# EAGLE design Solarregler (EAGLE 7.7.0)
TITLE: Hutschienen-Modul mit CAN-Bus und zwei ansteuerbaren Relais

## Sheet 1 of 6
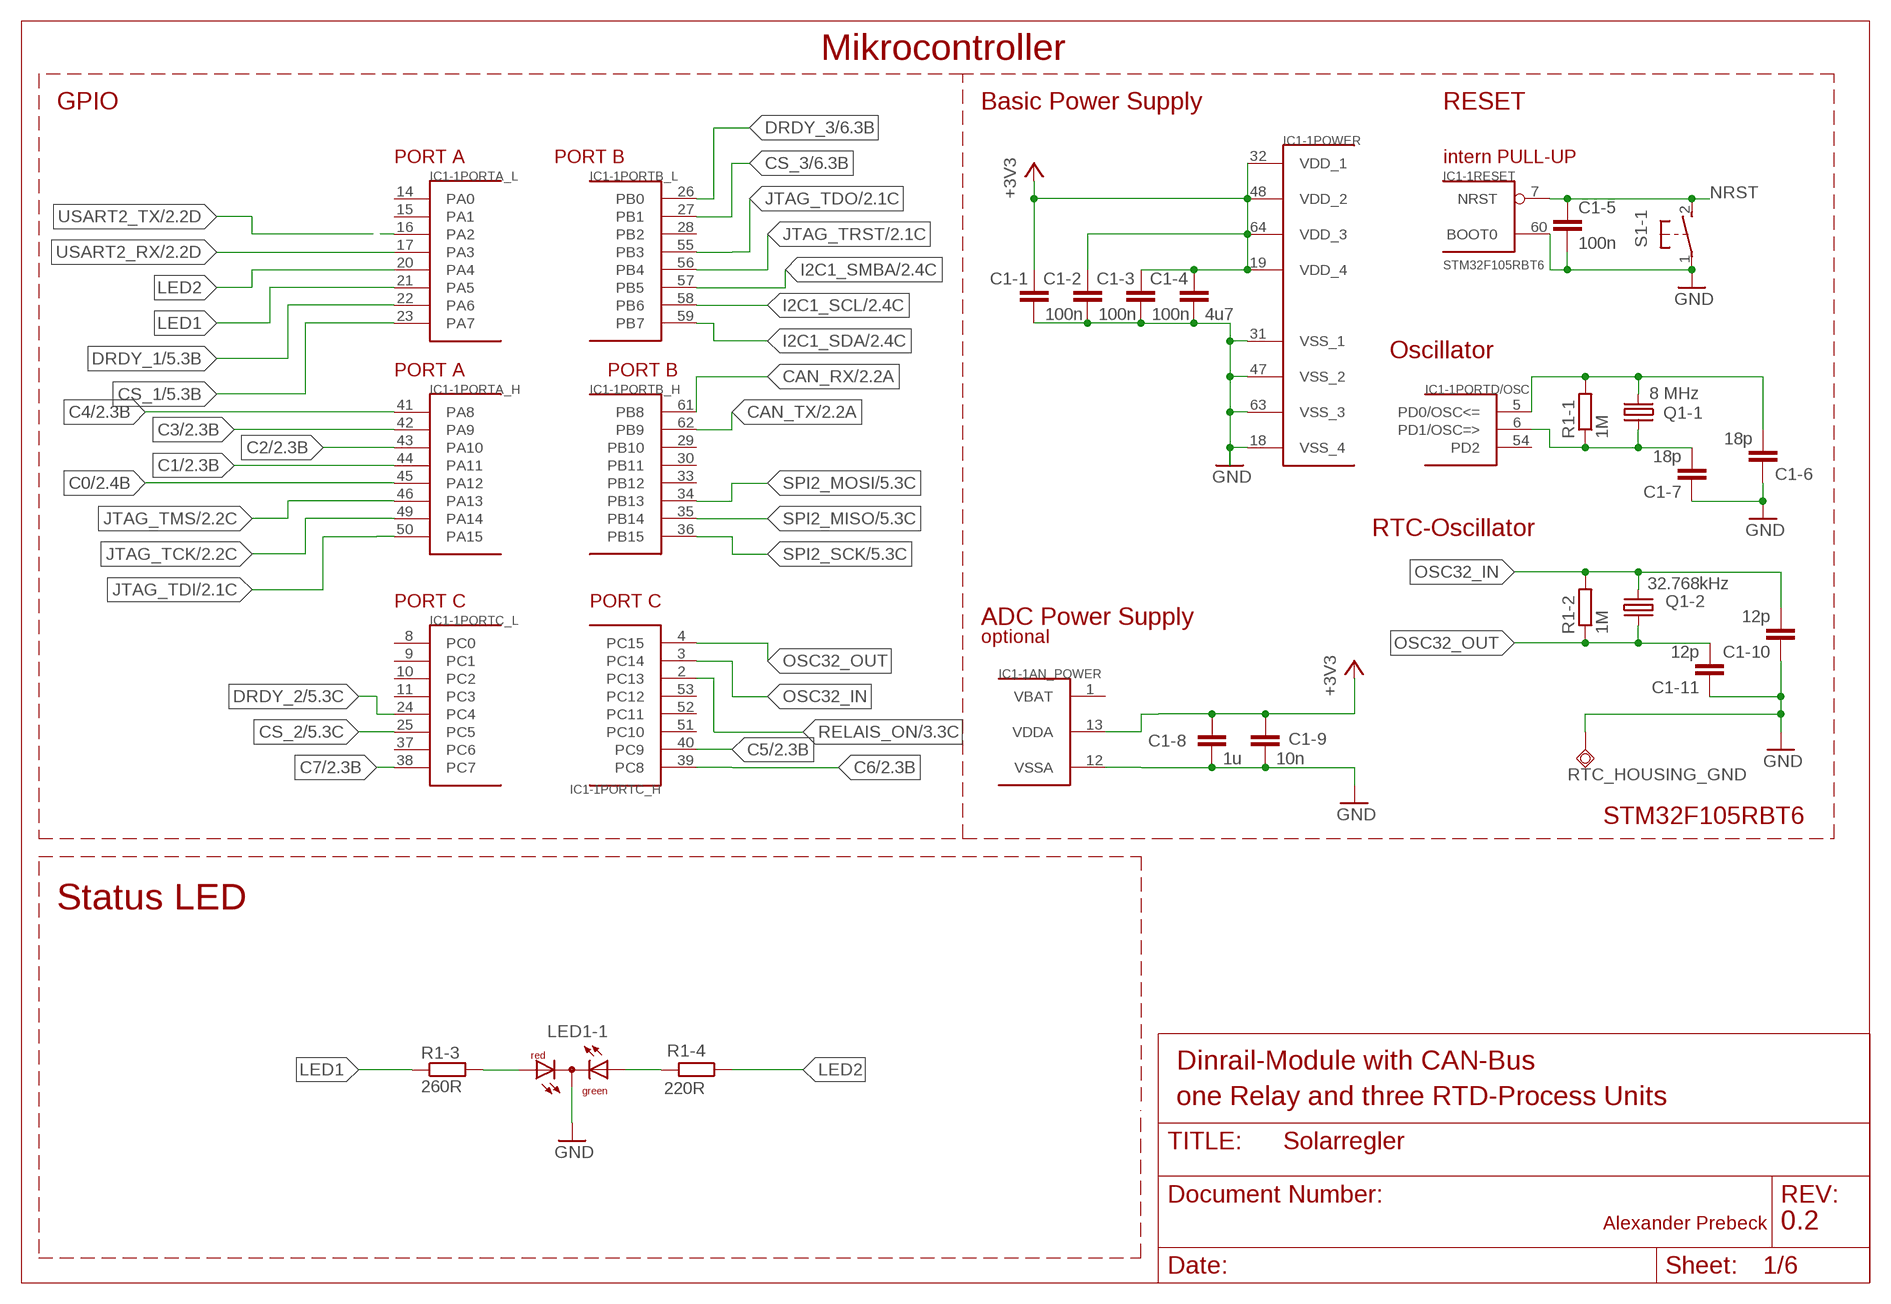
[diagram p0: schematic, sheet 1]

### Parts
C1-1  100n  C-EUC0603  [C0603]
C1-2  100n  C-EUC0603  [C0603]
C1-3  100n  C-EUC0603  [C0603]
C1-4  4u7  C-EUC1206  [C1206]
C1-5  100n  C-EUC0603  [C0603]
C1-6  18p  C-EUC0603  [C0603]
C1-7  18p  C-EUC0603  [C0603]
C1-8  1u  C-EUC0805  [C0805]
C1-9  10n  C-EUC0603  [C0603]
C1-10  12p  C-EUC0603  [C0603]
C1-11  12p  C-EUC0603  [C0603]
IC1-1  STM32F105RBT6  STM32F10XRXT6  [TQFP64]
LED1-1  DUOLED-RG-C  [DUOLED-C-5MM]
Q1-1  8 MHz  SMD_QUARZ_6X3.5MM  [SMD_QUARZ_6X3.5MM]
Q1-2  32.768kHz  QUARZ_RTC_TH  [THROUGH_HOLE_QUARZ_RTC]
R1-1  1M  R-EU_R0603  [R0603]
R1-2  1M  R-EU_R0603  [R0603]
R1-3  260R  R-EU_R0603  [R0603]
R1-4  220R  R-EU_R0603  [R0603]
RTC_HOUSING_GND  TPSQTP20SQ  [TP20SQ]
S1-1  31-XX  [B3F-31XX]

### Nets
+3V3: C1-1.1 C1-2.1 C1-3.1 C1-4.1 C1-8.1 C1-9.1 IC1-1.13(AN_POWER:VDDA) IC1-1.19(POWER:VDD_4) IC1-1.32(POWER:VDD_1) IC1-1.48(POWER:VDD_2) IC1-1.64(POWER:VDD_3) ; also sheet 2,3,5,6
C0: IC1-1.45(PORTA_H:PA12) ; also sheet 2
C1: IC1-1.44(PORTA_H:PA11) ; also sheet 2
C2: IC1-1.43(PORTA_H:PA10) ; also sheet 2
C3: IC1-1.42(PORTA_H:PA9) ; also sheet 2
C4: IC1-1.41(PORTA_H:PA8) ; also sheet 2
C5: IC1-1.40(PORTC_H:PC9) ; also sheet 2
C6: IC1-1.39(PORTC_H:PC8) ; also sheet 2
C7: IC1-1.38(PORTC_L:PC7) ; also sheet 2
CAN_RX: IC1-1.61(PORTB_H:PB8) ; also sheet 2
CAN_TX: IC1-1.62(PORTB_H:PB9) ; also sheet 2
CS_1: IC1-1.23(PORTA_L:PA7) ; also sheet 5
CS_2: IC1-1.25(PORTC_L:PC5) ; also sheet 5
CS_3: IC1-1.27(PORTB_L:PB1) ; also sheet 6
DRDY_1: IC1-1.22(PORTA_L:PA6) ; also sheet 5
DRDY_2: IC1-1.24(PORTC_L:PC4) ; also sheet 5
DRDY_3: IC1-1.26(PORTB_L:PB0) ; also sheet 6
GND: C1-1.2 C1-2.2 C1-3.2 C1-4.2 C1-5.2 C1-6.1 C1-7.1 C1-8.2 C1-9.2 C1-10.1 C1-11.1 IC1-1.12(AN_POWER:VSSA) IC1-1.18(POWER:VSS_4) IC1-1.31(POWER:VSS_1) IC1-1.47(POWER:VSS_2) IC1-1.60(RESET:BOOT0) IC1-1.63(POWER:VSS_3) LED1-1.C RTC_HOUSING_GND.TP S1-1.1(P) ; also sheet 2,3,4,5,6
I2C1_SCL: IC1-1.58(PORTB_L:PB6) ; also sheet 2,4
I2C1_SDA: IC1-1.59(PORTB_L:PB7) ; also sheet 2,4
I2C1_SMBA: IC1-1.57(PORTB_L:PB5) ; also sheet 2
JTAG_TCK: IC1-1.49(PORTA_H:PA14) ; also sheet 2
JTAG_TDI: IC1-1.50(PORTA_H:PA15) ; also sheet 2
JTAG_TDO: IC1-1.55(PORTB_L:PB3) ; also sheet 2
JTAG_TMS: IC1-1.46(PORTA_H:PA13) ; also sheet 2
JTAG_TRST: IC1-1.56(PORTB_L:PB4) ; also sheet 2
LED1: IC1-1.21(PORTA_L:PA5) R1-3.1
LED2: IC1-1.20(PORTA_L:PA4) R1-4.1
N$4: LED1-1.AX(AG) R1-4.2
N$13: LED1-1.AR R1-3.2
N$24: C1-7.2 IC1-1.6(PORTD/OSC:PD1/OSC=>) Q1-1.1 R1-1.1
N$29: C1-6.2 IC1-1.5(PORTD/OSC:PD0/OSC<=) Q1-1.2 R1-1.2
NRST: C1-5.1 IC1-1.7(RESET:NRST) S1-1.2(S) ; also sheet 2
OSC32_IN: C1-10.2 IC1-1.3(PORTC_H:PC14) Q1-2.P$1 R1-2.2
OSC32_OUT: C1-11.2 IC1-1.4(PORTC_H:PC15) Q1-2.P$2 R1-2.1
RELAIS_ON: IC1-1.2(PORTC_H:PC13) ; also sheet 3
SPI2_MISO: IC1-1.35(PORTB_H:PB14) ; also sheet 5,6
SPI2_MOSI: IC1-1.34(PORTB_H:PB13) ; also sheet 5,6
SPI2_SCK: IC1-1.36(PORTB_H:PB15) ; also sheet 5,6
USART2_RX: IC1-1.17(PORTA_L:PA3) ; also sheet 2
USART2_TX: IC1-1.16(PORTA_L:PA2) ; also sheet 2
Unconnected: IC1-1.8(PORTC_L:PC0) IC1-1.9(PORTC_L:PC1) IC1-1.10(PORTC_L:PC2) IC1-1.11(PORTC_L:PC3) IC1-1.14(PORTA_L:PA0) IC1-1.15(PORTA_L:PA1) IC1-1.28(PORTB_L:PB2) IC1-1.29(PORTB_H:PB10) IC1-1.30(PORTB_H:PB11) IC1-1.33(PORTB_H:PB12) IC1-1.37(PORTC_L:PC6) IC1-1.51(PORTC_H:PC10) IC1-1.52(PORTC_H:PC11) IC1-1.53(PORTC_H:PC12) IC1-1.54(PORTD/OSC:PD2)

### Notes on the sheet
- Mikrocontroller
- GPIO | Basic Power Supply | RESET
- PORT A | PORT B | intern PULL-UP
- Oscillator
- PORT A | PORT B
- RTC-Oscillator
- PORT C | PORT C
- ADC Power Supply
- optional
- STM32F105RBT6
- Status LED
- Dinrail-Module with CAN-Bus
- one Relay and three RTD-Process Units
- Alexander Prebeck | 0.2

## Sheet 2 of 6
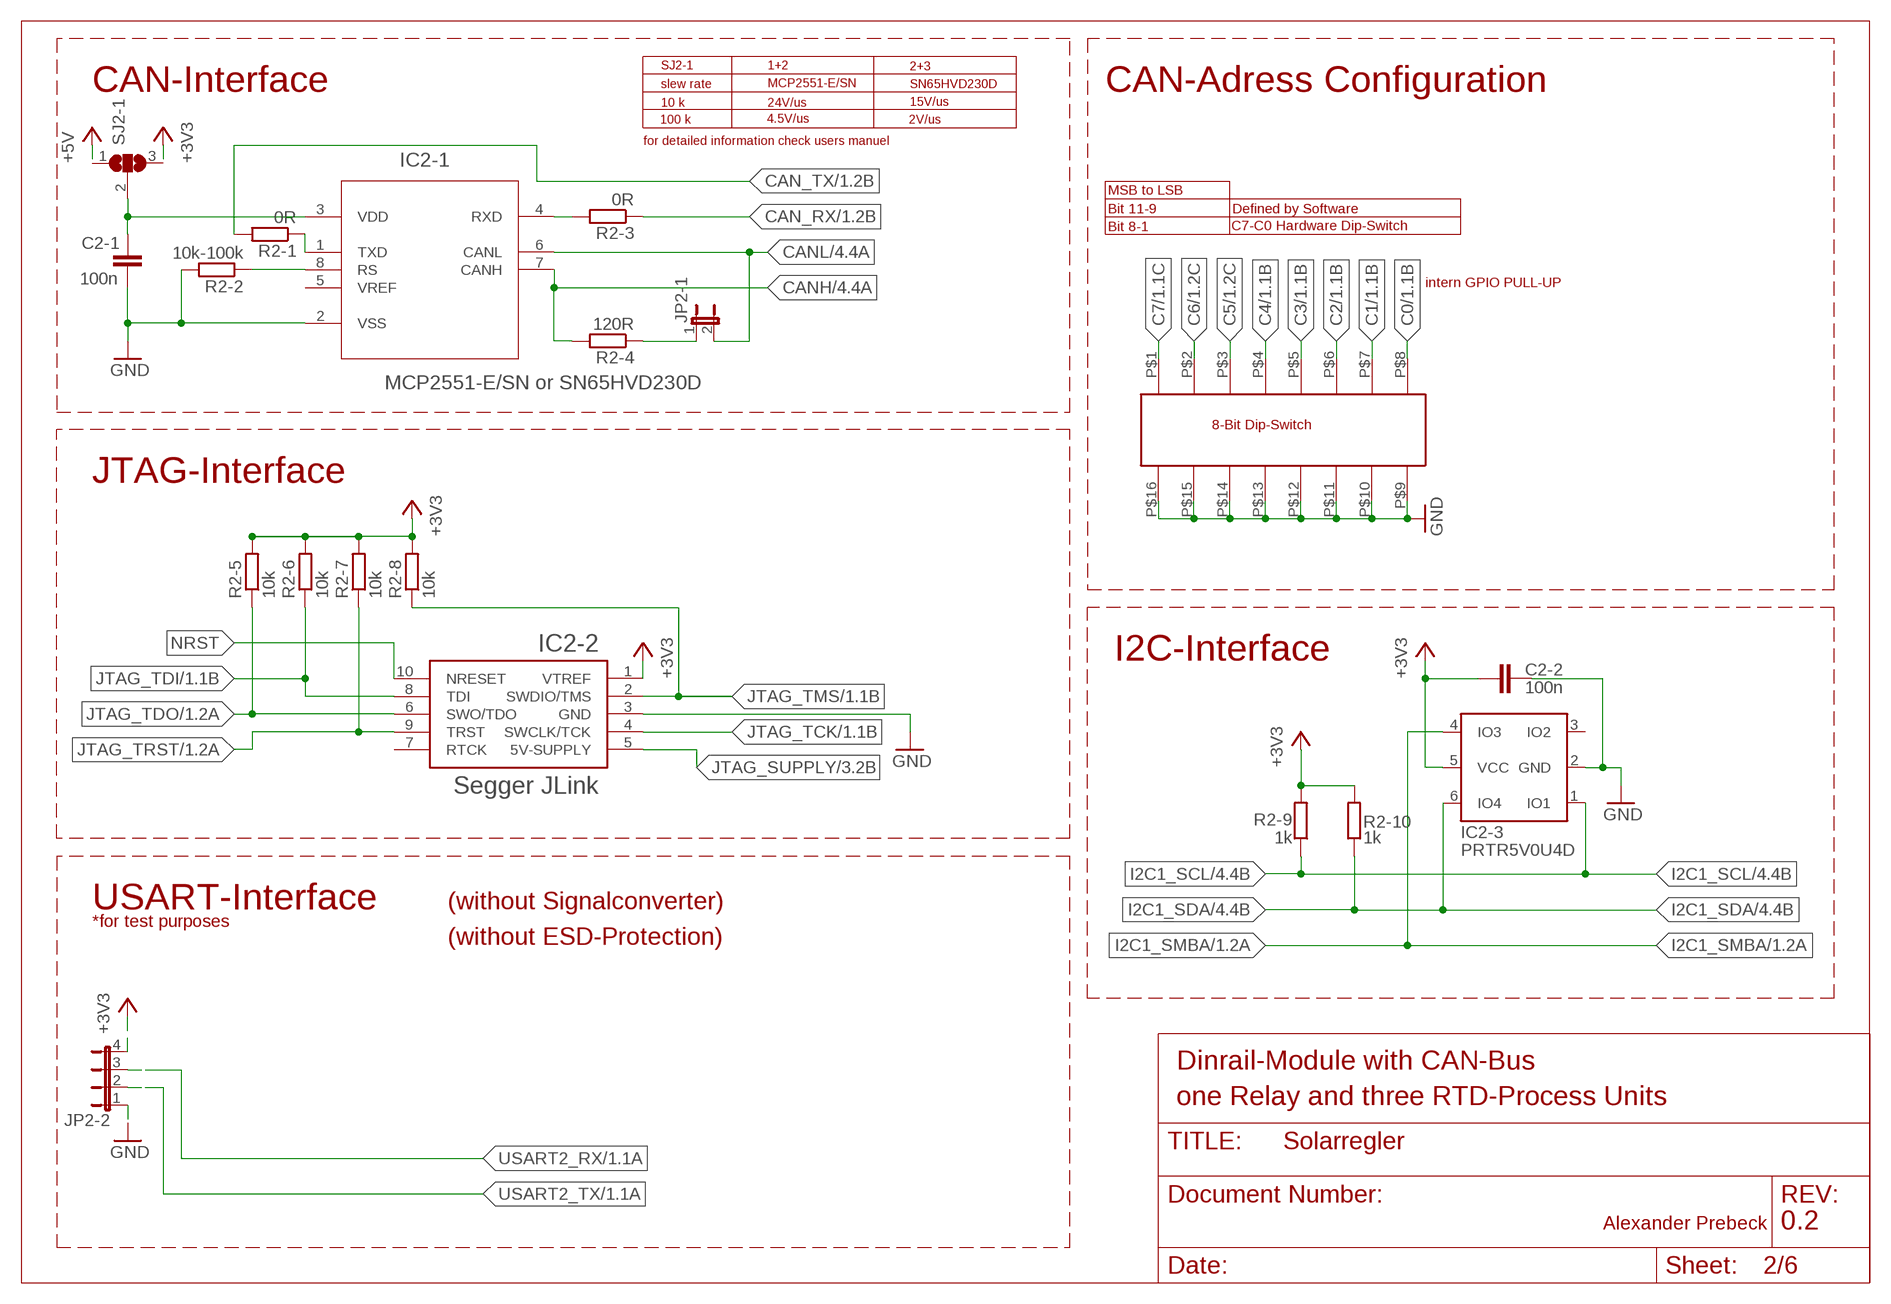
[diagram p1: schematic, sheet 2]

### Parts
C2-1  100n  C-EUC0603  [C0603]
C2-2  100n  C-EUC0603  [C0603]
DIP21  MULTICOMP  [MULTICOMP]
IC2-1  MCP2551-E/SN or SN65HVD230D  MCP2551-E/SN  [SOIC127P600X175-8N]
IC2-2  J-LINK-10PIN-HOLES  [J-LINK-10PIN-HOLES]
IC2-3  PRTR5V0U4D  [SC74]
JP2-1  JP1E  [JP1]
JP2-2  JP4E  [JP4]
R2-1  0R  R-EU_R0603  [R0603]
R2-2  10k-100k  R-EU_R0603  [R0603]
R2-3  0R  R-EU_R0603  [R0603]
R2-4  120R  R-EU_R0603  [R0603]
R2-5  10k  R-EU_R0603  [R0603]
R2-6  10k  R-EU_R0603  [R0603]
R2-7  10k  R-EU_R0603  [R0603]
R2-8  10k  R-EU_R0603  [R0603]
R2-9  1k  R-EU_R0603  [R0603]
R2-10  1k  R-EU_R0603  [R0603]
SJ2-1  SJ2W  [SJ_2]

### Nets
+3V3: C2-2.1 IC2-2.1(VTREF) IC2-3.5(VCC) JP2-2.4 R2-5.2 R2-6.2 R2-7.2 R2-8.2 R2-9.2 R2-10.2 SJ2-1.3 ; also sheet 1,3,5,6
+5V: SJ2-1.1 ; also sheet 3
C0: DIP21.P$8 ; also sheet 1
C1: DIP21.P$7 ; also sheet 1
C2: DIP21.P$6 ; also sheet 1
C3: DIP21.P$5 ; also sheet 1
C4: DIP21.P$4 ; also sheet 1
C5: DIP21.P$3 ; also sheet 1
C6: DIP21.P$2 ; also sheet 1
C7: DIP21.P$1 ; also sheet 1
CAN_RX: R2-3.1 ; also sheet 1
CAN_TERM2: JP2-1.1 R2-4.1
CAN_TX: R2-1.2 ; also sheet 1
CANH: IC2-1.7(CANH) R2-4.2 ; also sheet 4
CANL: IC2-1.6(CANL) JP2-1.2 ; also sheet 4
GND: C2-1.2 C2-2.2 DIP21.P$9 DIP21.P$10 DIP21.P$11 DIP21.P$12 DIP21.P$13 DIP21.P$14 DIP21.P$15 DIP21.P$16 IC2-1.2(VSS) IC2-2.3(GND) IC2-3.2(GND) JP2-2.1 R2-2.2 ; also sheet 1,3,4,5,6
I2C1_SCL: IC2-3.1(IO1) R2-9.1 ; also sheet 1,4
I2C1_SDA: IC2-3.6(IO4) R2-10.1 ; also sheet 1,4
I2C1_SMBA: IC2-3.4(IO3) ; also sheet 1
JTAG_SUPPLY: IC2-2.5(5V-SUPPLY) ; also sheet 3
JTAG_TCK: IC2-2.4(SWCLK/TCK) ; also sheet 1
JTAG_TDI: IC2-2.8(TDI) R2-6.1 ; also sheet 1
JTAG_TDO: IC2-2.6(SWO/TDO) R2-5.1 ; also sheet 1
JTAG_TMS: IC2-2.2(SWDIO/TMS) R2-8.1 ; also sheet 1
JTAG_TRST: IC2-2.9(TRST) R2-7.1 ; also sheet 1
N$5: IC2-1.4(RXD) R2-3.2
N$8: IC2-1.1(TXD) R2-1.1
N$9: IC2-1.8(RS) R2-2.1
N$21: C2-1.1 IC2-1.3(VDD) SJ2-1.2
NRST: IC2-2.10(NRESET) ; also sheet 1
USART2_RX: JP2-2.3 ; also sheet 1
USART2_TX: JP2-2.2 ; also sheet 1
Unconnected: IC2-1.5(VREF) IC2-2.7(RTCK) IC2-3.3(IO2)

### Notes on the sheet
- SJ2-1 | 1+2 | 2+3
- slew rate | MCP2551-E/SN | SN65HVD230D
- CAN-Interface | CAN-Adress Configuration
- 10 k | 24V/us | 15V/us
- 100 k | 4.5V/us | 2V/us
- for detailed information check users manuel
- MSB to LSB
- Bit 11-9 | Defined by Software
- Bit 8-1 | C7-C0 Hardware Dip-Switch
- intern GPIO PULL-UP
- 8-Bit Dip-Switch
- JTAG-Interface
- I2C-Interface
- USART-Interface | (without Signalconverter)
- *for test purposes
- (without ESD-Protection)
- Dinrail-Module with CAN-Bus
- one Relay and three RTD-Process Units
- Alexander Prebeck | 0.2

## Sheet 3 of 6
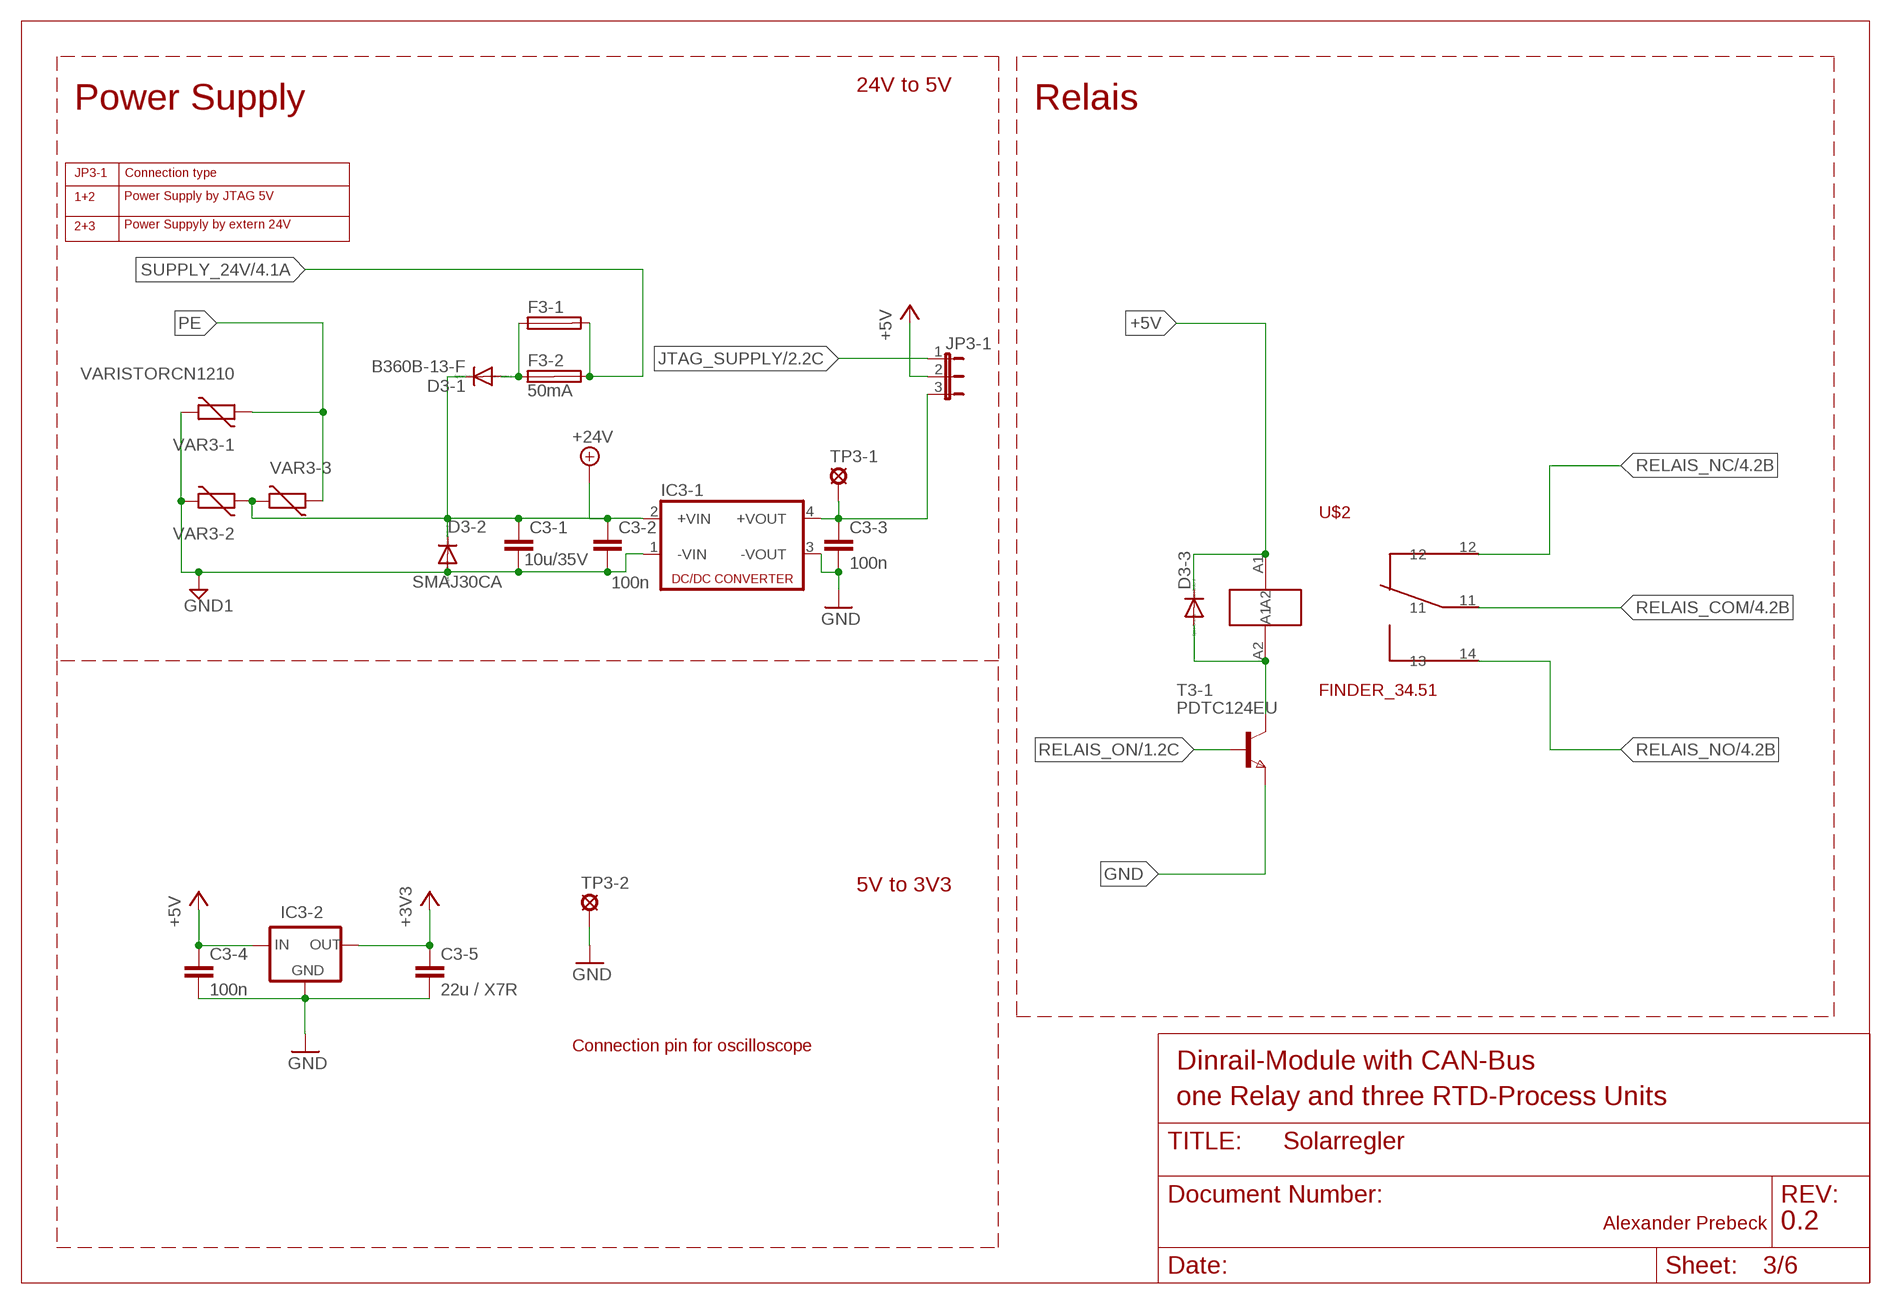
[diagram p2: schematic, sheet 3]

### Parts
C3-1  10u/35V  C-EUC0805  [C0805]
C3-2  100n  C-EUC0603  [C0603]
C3-3  100n  C-EUC0603  [C0603]
C3-4  100n  C-EUC0603  [C0603]
C3-5  22u / X7R  C-EUC0805  [C0805]
D3-1  B360B-13-F  DIODE-SMB  [SMB]
D3-2  SMAJ30CA  DIODE-DO214AA  [DO214AA]
D3-3  DIODE-SMB  [SMB]
F3-1  FUSE_1210  [1210]
F3-2  50mA  SHK20Q  [SHK20Q]
IC3-1  SIM1  [4SIL]
IC3-2  MIC5209  [SOT223]
JP3-1  JP2E  [JP2]
T3-1  PDTC124EU  NPNSOT323  [SOT323]
TP3-1  LSP10  [LSP10]
TP3-2  LSP10  [LSP10]
U$2  FINDER_34.51  [SERIES_34]
VAR3-1  VARISTORCN1210  [CT/CN1210]
VAR3-2  VARISTORCN1210  [CT/CN1210]
VAR3-3  VARISTORCN1210  [CT/CN1210]

### Nets
+3V3: C3-5.1 IC3-2.3(OUT) ; also sheet 1,2,5,6
+5V: C3-4.1 D3-3.C IC3-2.1(IN) JP3-1.2 U$2.A1 ; also sheet 2
+24V [24V]: C3-1.1 C3-2.1 D3-1.C D3-2.C IC3-1.2(+VIN) VAR3-2.2 VAR3-3.2
GND: C3-3.2 C3-4.2 C3-5.2 IC3-1.3(-VOUT) IC3-2.2(GND) IC3-2.4(GND) T3-1.3(E) TP3-2.MP ; also sheet 1,2,4,5,6
GND1 [24V]: C3-1.2 C3-2.2 D3-2.A IC3-1.1(-VIN) VAR3-1.1 VAR3-2.1 ; also sheet 4
JTAG_SUPPLY: JP3-1.1 ; also sheet 2
N$10: D3-3.A T3-1.1(C) U$2.A2
N$17: C3-3.1 IC3-1.4(+VOUT) JP3-1.3 TP3-1.MP
N$19 [24V]: D3-1.A F3-1.1 F3-2.1A
PE [24V]: VAR3-1.2 VAR3-3.1 ; also sheet 4
RELAIS_COM [230V]: U$2.11 ; also sheet 4
RELAIS_NC [230V]: U$2.12 ; also sheet 4
RELAIS_NO [230V]: U$2.14 ; also sheet 4
RELAIS_ON: T3-1.2(B) ; also sheet 1
SUPPLY_24V [24V]: F3-1.2 F3-2.2A ; also sheet 4
Unconnected: F3-2.1B F3-2.2B

### Notes on the sheet
- 24V to 5V
- Power Supply | Relais
- JP3-1 | Connection type
- 1+2 | Power Supply by JTAG 5V
- 2+3 | Power Suppyly by extern 24V
- 5V to 3V3
- Connection pin for oscilloscope
- Dinrail-Module with CAN-Bus
- one Relay and three RTD-Process Units
- Alexander Prebeck | 0.2

## Sheet 4 of 6
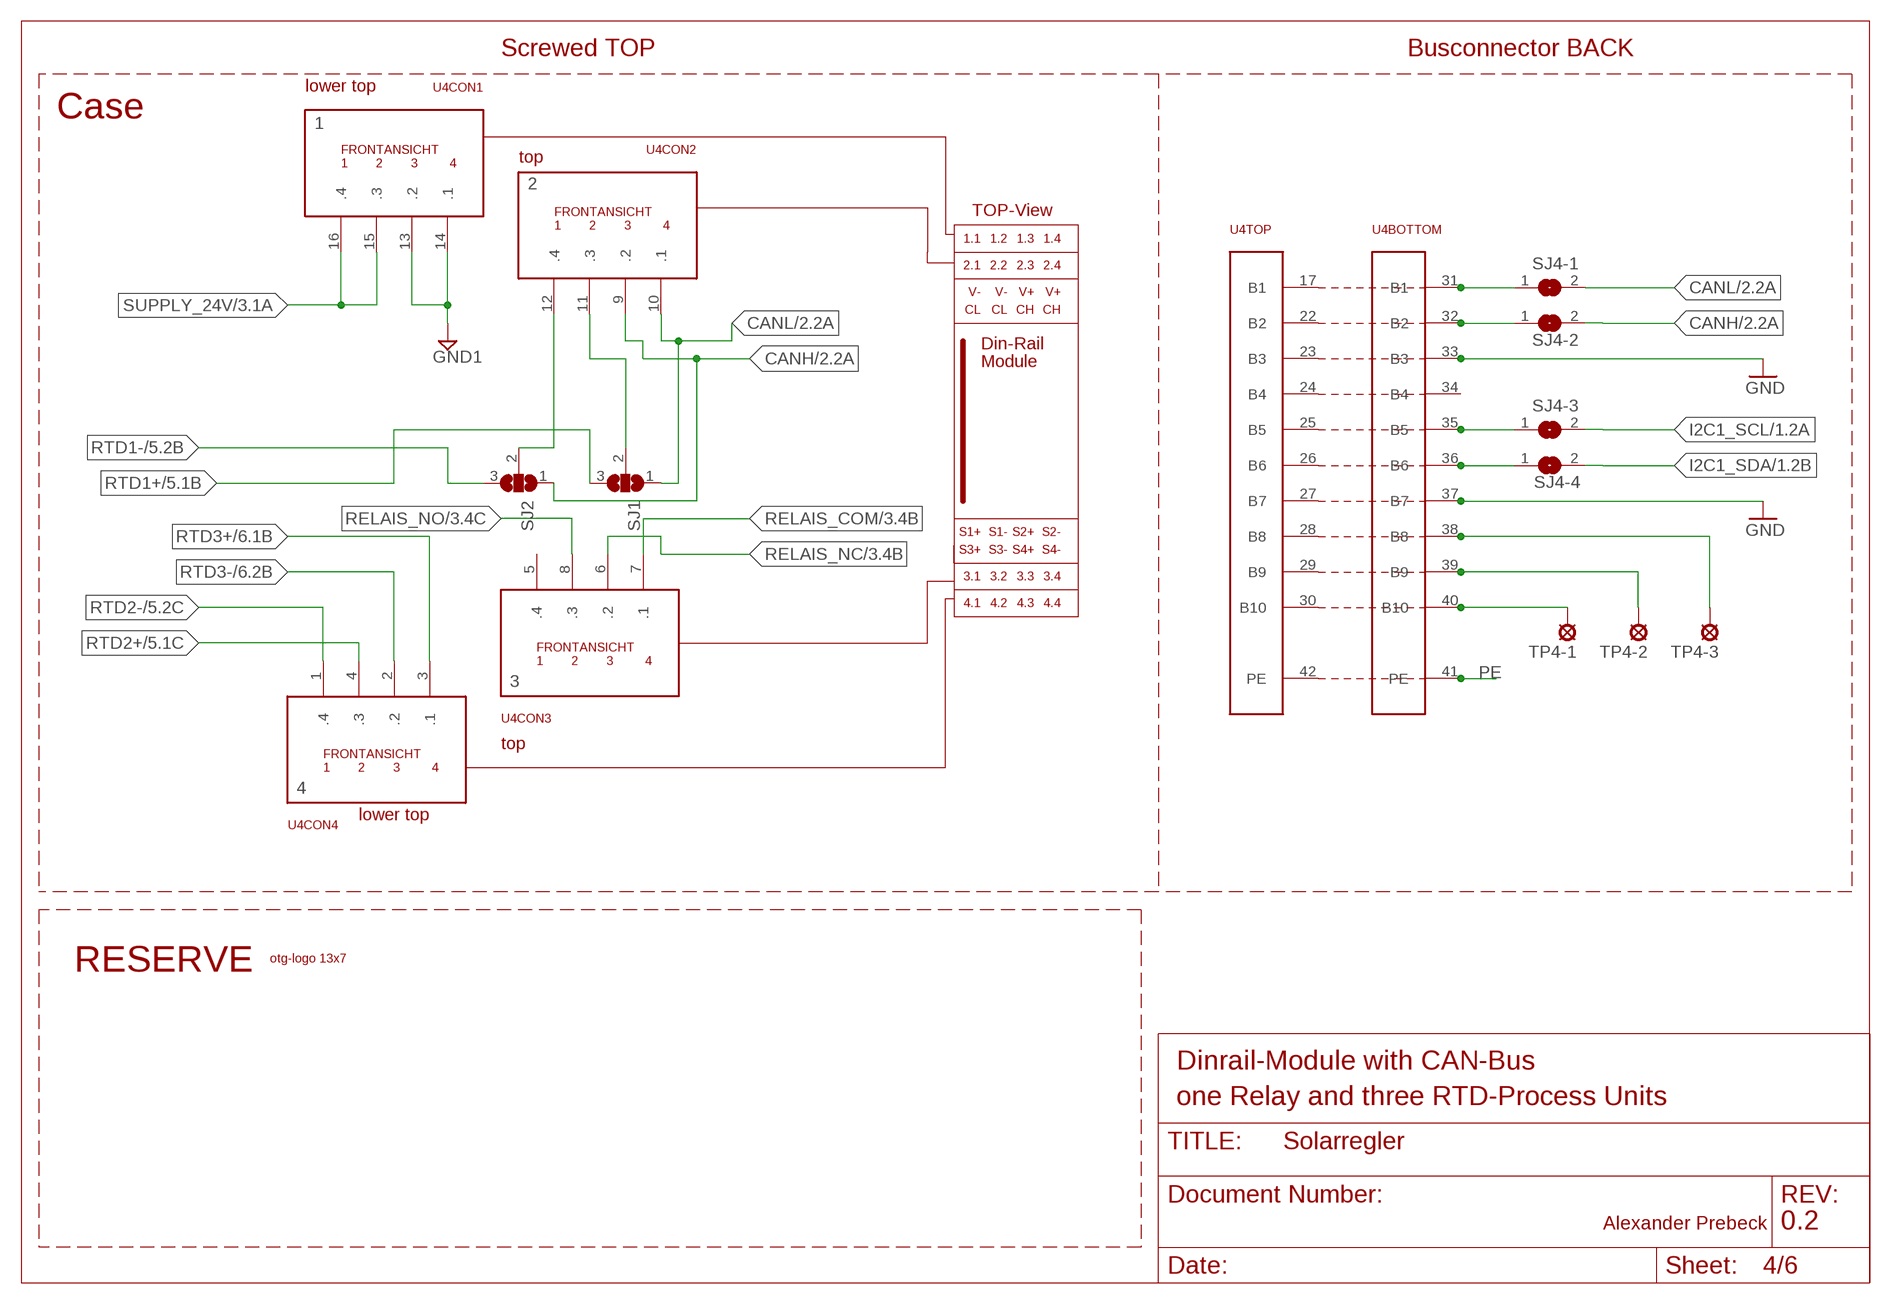
[diagram p3: schematic, sheet 4]

### Parts
SJ1  SJ2W  [SJ_2]
SJ2  SJ2W  [SJ_2]
SJ4-1  SJW  [SJW]
SJ4-2  SJW  [SJW]
SJ4-3  SJW  [SJW]
SJ4-4  SJW  [SJW]
TP4-1  LSP10  [LSP10]
TP4-2  LSP10  [LSP10]
TP4-3  LSP10  [LSP10]
U4  HUTSCHIENE_DEV  [HUTSCHIENE]
U$1  OTH-LOGO13X7  [OTH-LOGO_SMALL]

### Nets
CANH: SJ2.1 SJ4-2.2 U4.9(CON2:.2) ; also sheet 2
CANL: SJ1.1 SJ4-1.2 U4.10(CON2:.1) ; also sheet 2
GND: U4.33(BOTTOM:B3) U4.37(BOTTOM:B7) ; also sheet 1,2,3,5,6
GND1 [24V]: U4.13(CON1:.2) U4.14(CON1:.1) ; also sheet 3
I2C1_SCL: SJ4-3.2 ; also sheet 1,2
I2C1_SDA: SJ4-4.2 ; also sheet 1,2
N$11: SJ1.2 U4.11(CON2:.3)
N$12: SJ2.2 U4.12(CON2:.4)
N$18: SJ4-1.1 U4.31(BOTTOM:B1)
N$20: SJ4-2.1 U4.32(BOTTOM:B2)
N$22: SJ4-3.1 U4.35(BOTTOM:B5)
N$23: SJ4-4.1 U4.36(BOTTOM:B6)
N$76: U4.34(BOTTOM:B4)
N$77: TP4-3.MP U4.38(BOTTOM:B8)
N$78: TP4-2.MP U4.39(BOTTOM:B9)
N$79: TP4-1.MP U4.40(BOTTOM:B10)
PE [24V]: U4.41(BOTTOM:PE) ; also sheet 3
RELAIS_COM [230V]: U4.7(CON3:.1) ; also sheet 3
RELAIS_NC [230V]: U4.6(CON3:.2) ; also sheet 3
RELAIS_NO [230V]: U4.8(CON3:.3) ; also sheet 3
RTD1+: SJ1.3 ; also sheet 5
RTD1-: SJ2.3 ; also sheet 5
RTD2+: U4.4(CON4:.3) ; also sheet 5
RTD2-: U4.1(CON4:.4) ; also sheet 5
RTD3+: U4.3(CON4:.1) ; also sheet 6
RTD3-: U4.2(CON4:.2) ; also sheet 6
SUPPLY_24V [24V]: U4.15(CON1:.3) U4.16(CON1:.4) ; also sheet 3
Unconnected: U4.5(CON3:.4) U4.17(TOP:B1) U4.22(TOP:B2) U4.23(TOP:B3) U4.24(TOP:B4) U4.25(TOP:B5) U4.26(TOP:B6) U4.27(TOP:B7) U4.28(TOP:B8) U4.29(TOP:B9) U4.30(TOP:B10) U4.42(TOP:PE)

### Notes on the sheet
- Screwed TOP | Busconnector BACK
- Case | lower top
- 1
- top
- 2
- TOP-View
- 1.1 | 1.2 | 1.3 | 1.4
- 2.1 | 2.2 | 2.3 | 2.4
- V- | V- | V+ | V+
- CL | CL | CH | CH
- Din-Rail
- Module
- S1+ | S1- | S2+ | S2-
- S3+ | S3- | S4+ | S4-
- 3.1 | 3.2 | 3.3 | 3.4
- 4.1 | 4.2 | 4.3 | 4.4
- 3
- top
- 4
- lower top
- RESERVE
- Dinrail-Module with CAN-Bus
- one Relay and three RTD-Process Units
- Alexander Prebeck | 0.2

## Sheet 5 of 6
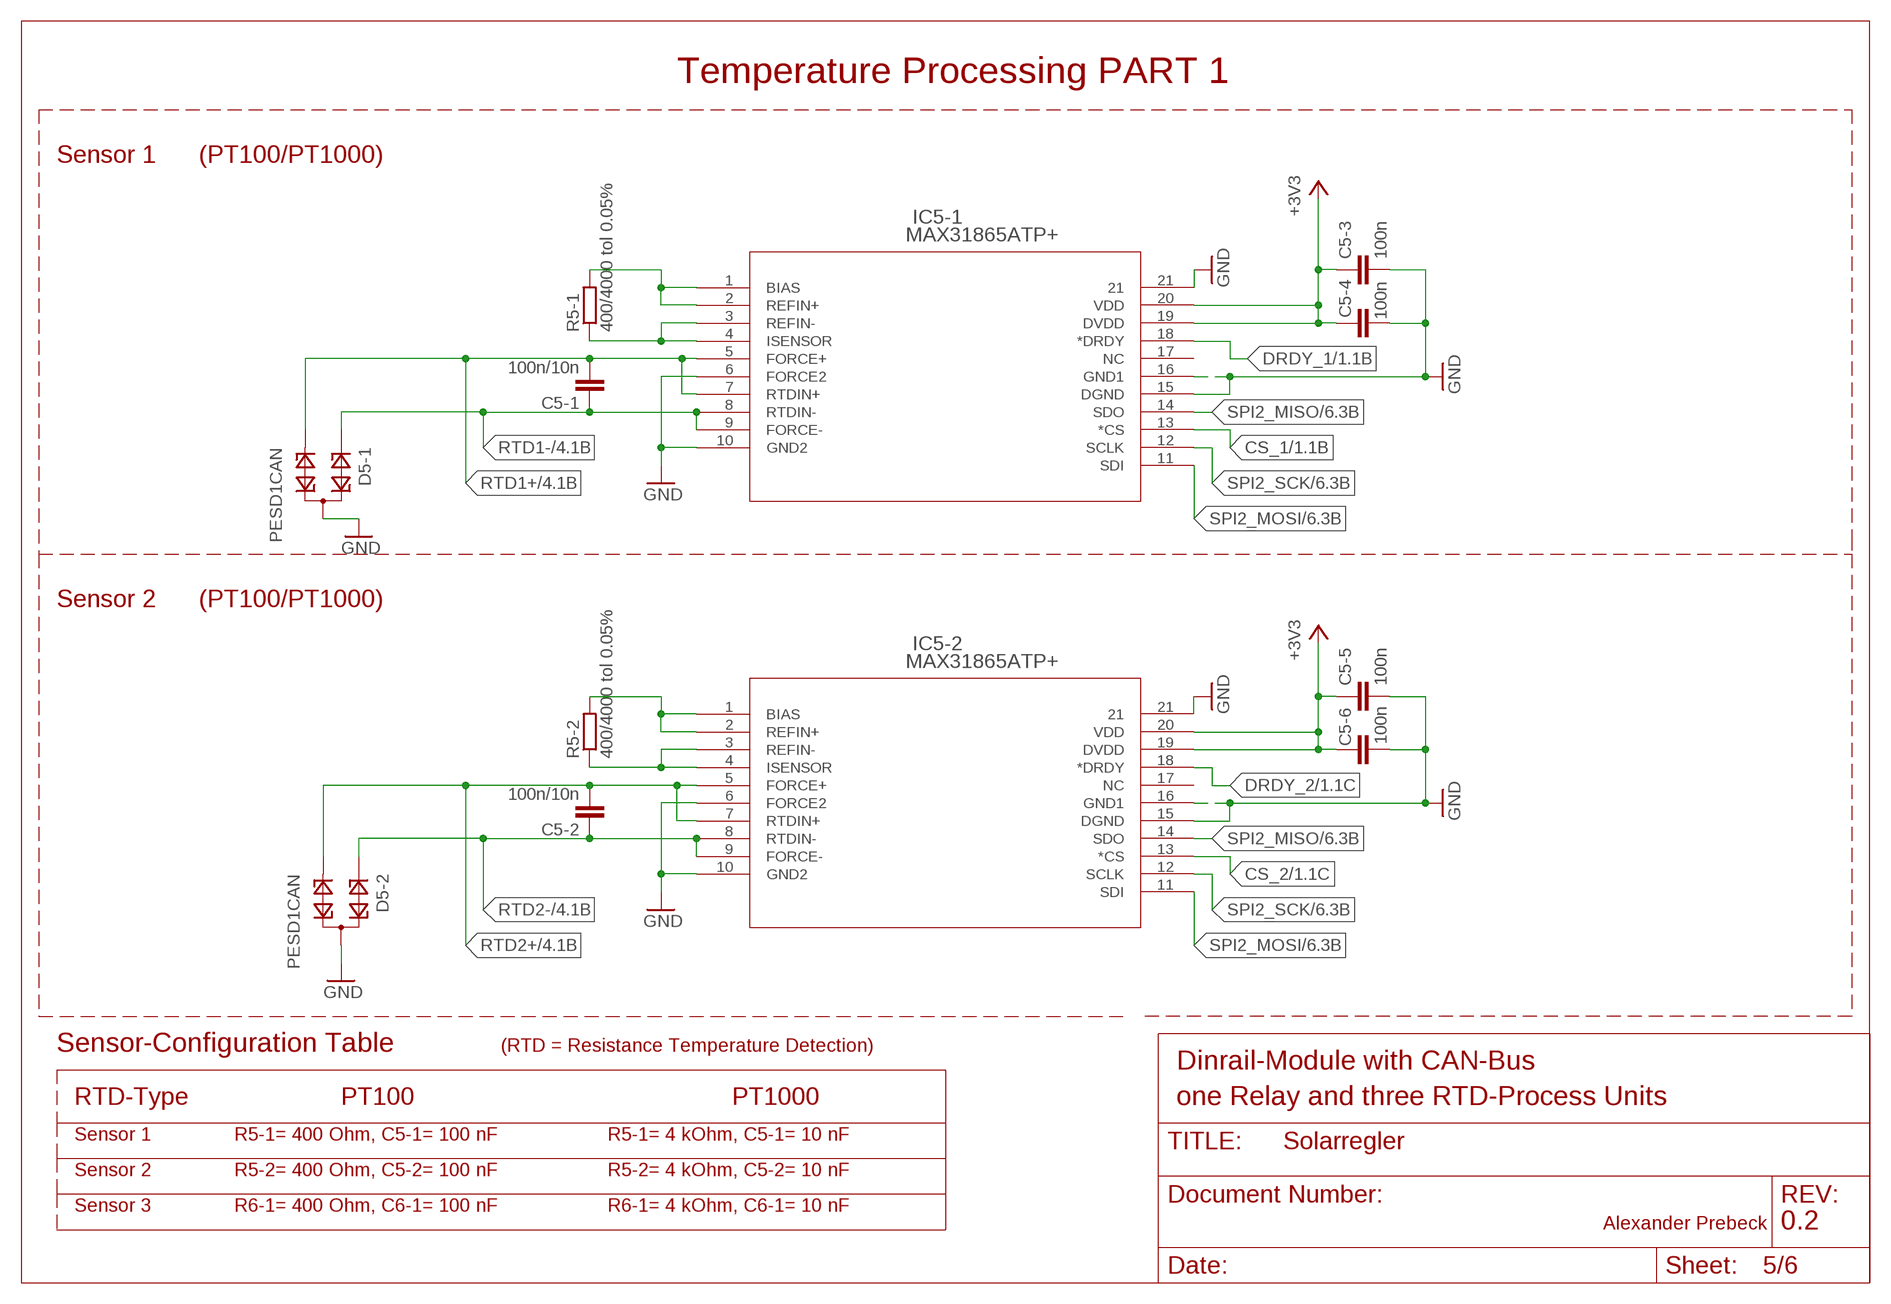
[diagram p4: schematic, sheet 5]

### Parts
C5-1  100n/10n  C-EUC0603  [C0603]
C5-2  100n/10n  C-EUC0603  [C0603]
C5-3  100n  C-EUC0603  [C0603]
C5-4  100n  C-EUC0603  [C0603]
C5-5  100n  C-EUC0603  [C0603]
C5-6  100n  C-EUC0603  [C0603]
D5-1  PESD1CAN  [SOT23]
D5-2  PESD1CAN  [SOT23]
IC5-1  MAX31865ATP+  [21-0140L_T2055-5]
IC5-2  MAX31865ATP+  [21-0140L_T2055-5]
R5-1  400/4000 tol 0.05%  R-EU_R0603  [R0603]
R5-2  400/4000 tol 0.05%  R-EU_R0603  [R0603]

### Nets
+3V3: C5-3.1 C5-4.1 C5-5.1 C5-6.1 IC5-1.19(DVDD) IC5-1.20(VDD) IC5-2.19(DVDD) IC5-2.20(VDD) ; also sheet 1,2,3,6
CS_1: IC5-1.13(*CS) ; also sheet 1
CS_2: IC5-2.13(*CS) ; also sheet 1
DRDY_1: IC5-1.18(*DRDY) ; also sheet 1
DRDY_2: IC5-2.18(*DRDY) ; also sheet 1
GND: C5-3.2 C5-4.2 C5-5.2 C5-6.2 D5-1.3 D5-2.3 IC5-1.6(FORCE2) IC5-1.10(GND2) IC5-1.15(DGND) IC5-1.16(GND1) IC5-1.21 IC5-2.6(FORCE2) IC5-2.10(GND2) IC5-2.15(DGND) IC5-2.16(GND1) IC5-2.21 ; also sheet 1,2,3,4,6
N$1: IC5-1.1(BIAS) IC5-1.2(REFIN+) R5-1.2
N$2: IC5-1.3(REFIN-) IC5-1.4(ISENSOR) R5-1.1
N$3: IC5-2.1(BIAS) IC5-2.2(REFIN+) R5-2.2
N$6: IC5-2.3(REFIN-) IC5-2.4(ISENSOR) R5-2.1
RTD1+: C5-1.2 D5-1.2 IC5-1.5(FORCE+) IC5-1.7(RTDIN+) ; also sheet 4
RTD1-: C5-1.1 D5-1.1 IC5-1.8(RTDIN-) IC5-1.9(FORCE-) ; also sheet 4
RTD2+: C5-2.2 D5-2.2 IC5-2.5(FORCE+) IC5-2.7(RTDIN+) ; also sheet 4
RTD2-: C5-2.1 D5-2.1 IC5-2.8(RTDIN-) IC5-2.9(FORCE-) ; also sheet 4
SPI2_MISO: IC5-1.14(SDO) IC5-2.14(SDO) ; also sheet 1,6
SPI2_MOSI: IC5-1.11(SDI) IC5-2.11(SDI) ; also sheet 1,6
SPI2_SCK: IC5-1.12(SCLK) IC5-2.12(SCLK) ; also sheet 1,6
Unconnected: IC5-1.17(NC) IC5-2.17(NC)

### Notes on the sheet
- Temperature Processing PART 1
- Sensor 1 | (PT100/PT1000)
- Sensor 2 | (PT100/PT1000)
- Sensor-Configuration Table | (RTD = Resistance Temperature Detection)
- Dinrail-Module with CAN-Bus
- RTD-Type | PT100 | PT1000 | one Relay and three RTD-Process Units
- Sensor 1 | R5-1= 400 Ohm, C5-1= 100 nF | R5-1= 4 kOhm, C5-1= 10 nF
- Sensor 2 | R5-2= 400 Ohm, C5-2= 100 nF | R5-2= 4 kOhm, C5-2= 10 nF
- Sensor 3 | R6-1= 400 Ohm, C6-1= 100 nF | R6-1= 4 kOhm, C6-1= 10 nF
- Alexander Prebeck | 0.2

## Sheet 6 of 6
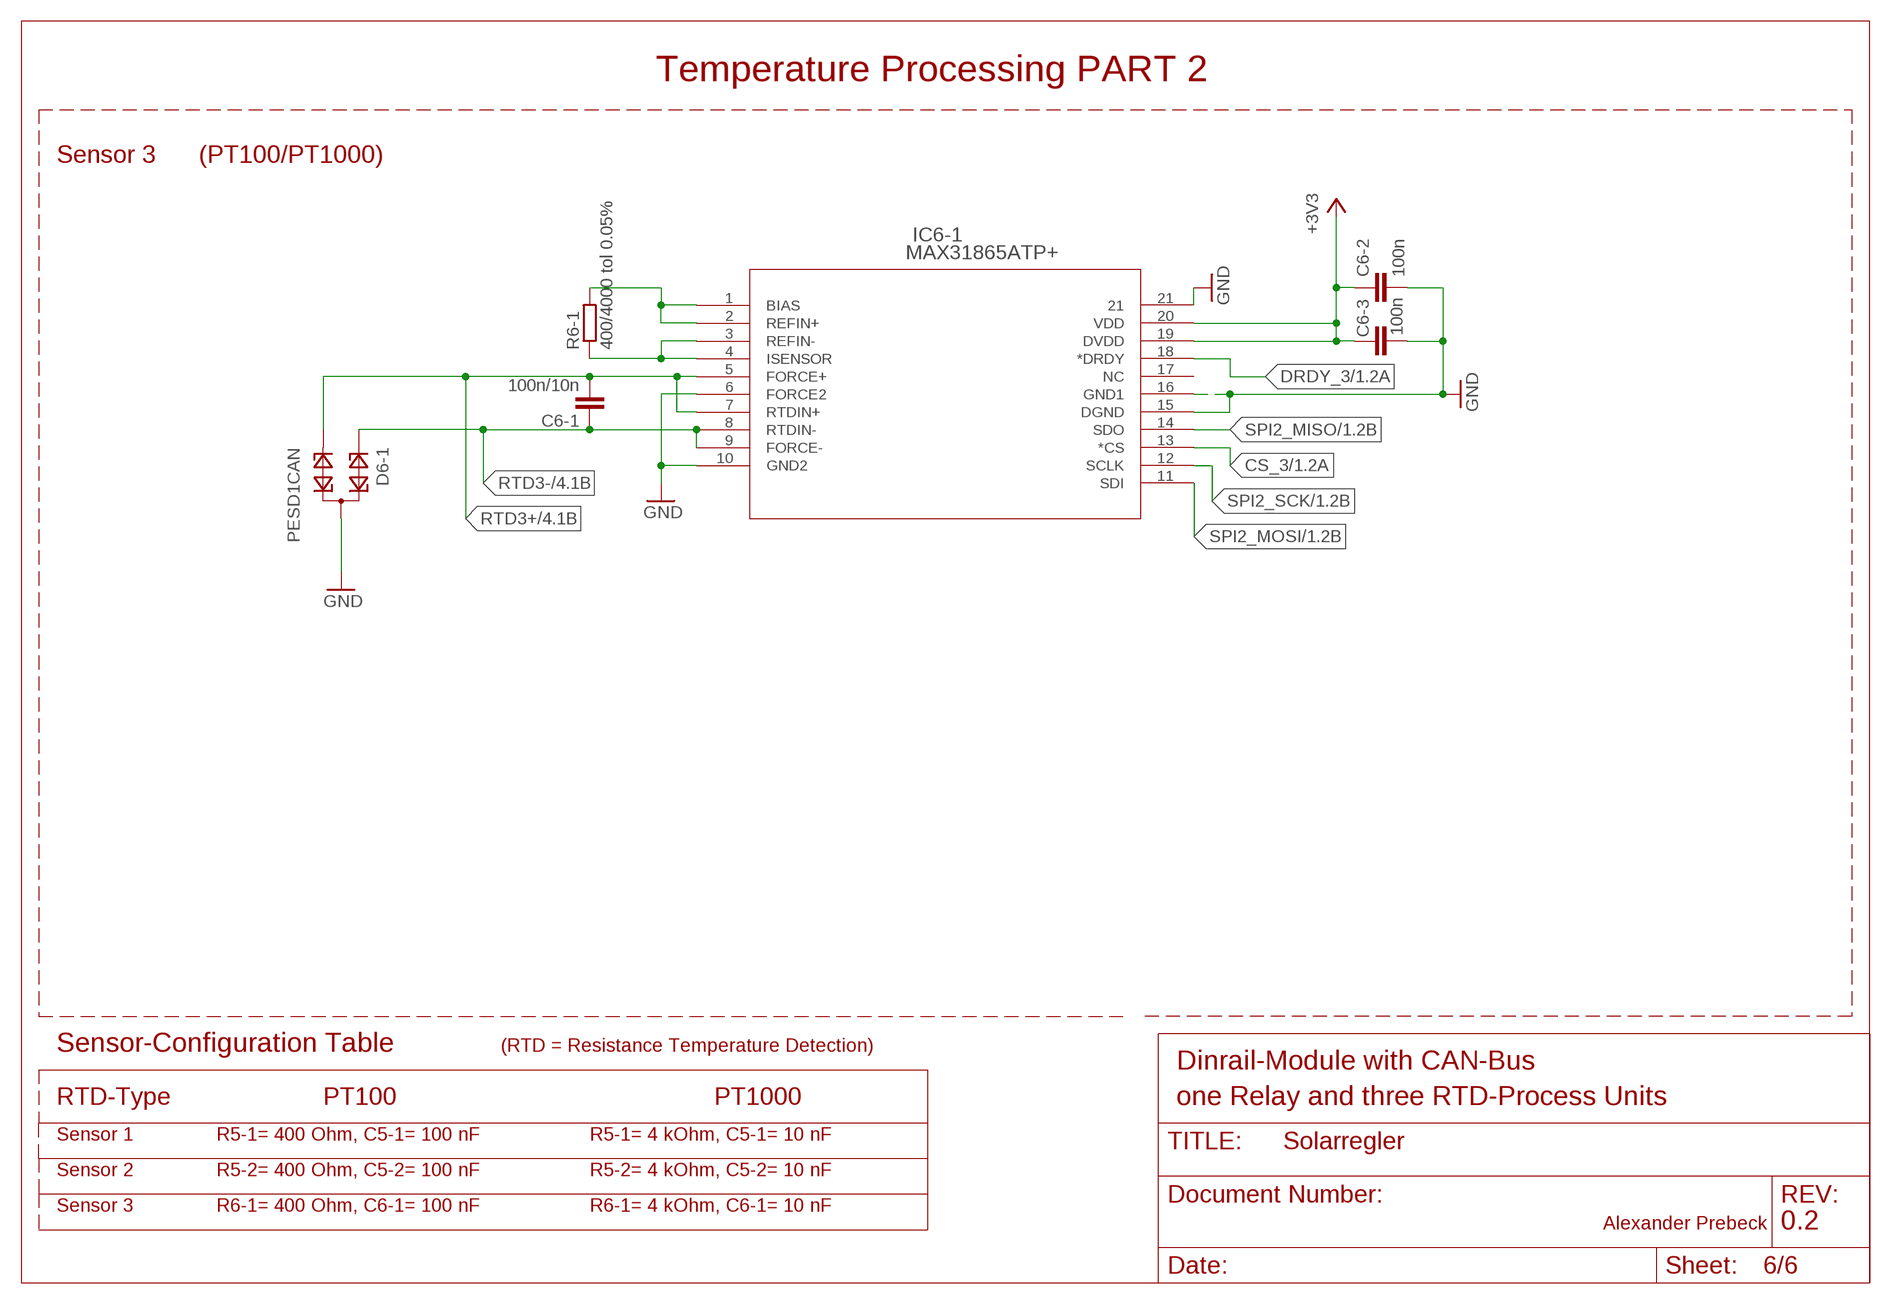
[diagram p5: schematic, sheet 6]

### Parts
C6-1  100n/10n  C-EUC0603  [C0603]
C6-2  100n  C-EUC0603  [C0603]
C6-3  100n  C-EUC0603  [C0603]
D6-1  PESD1CAN  [SOT23]
IC6-1  MAX31865ATP+  [21-0140L_T2055-5]
R6-1  400/4000 tol 0.05%  R-EU_R0603  [R0603]

### Nets
+3V3: C6-2.1 C6-3.1 IC6-1.19(DVDD) IC6-1.20(VDD) ; also sheet 1,2,3,5
CS_3: IC6-1.13(*CS) ; also sheet 1
DRDY_3: IC6-1.18(*DRDY) ; also sheet 1
GND: C6-2.2 C6-3.2 D6-1.3 IC6-1.6(FORCE2) IC6-1.10(GND2) IC6-1.15(DGND) IC6-1.16(GND1) IC6-1.21 ; also sheet 1,2,3,4,5
N$14: IC6-1.1(BIAS) IC6-1.2(REFIN+) R6-1.2
N$15: IC6-1.3(REFIN-) IC6-1.4(ISENSOR) R6-1.1
RTD3+: C6-1.2 D6-1.2 IC6-1.5(FORCE+) IC6-1.7(RTDIN+) ; also sheet 4
RTD3-: C6-1.1 D6-1.1 IC6-1.8(RTDIN-) IC6-1.9(FORCE-) ; also sheet 4
SPI2_MISO: IC6-1.14(SDO) ; also sheet 1,5
SPI2_MOSI: IC6-1.11(SDI) ; also sheet 1,5
SPI2_SCK: IC6-1.12(SCLK) ; also sheet 1,5
Unconnected: IC6-1.17(NC)

### Notes on the sheet
- Temperature Processing PART 2
- Sensor 3 | (PT100/PT1000)
- Sensor-Configuration Table | (RTD = Resistance Temperature Detection)
- Dinrail-Module with CAN-Bus
- RTD-Type | PT100 | PT1000 | one Relay and three RTD-Process Units
- Sensor 1 | R5-1= 400 Ohm, C5-1= 100 nF | R5-1= 4 kOhm, C5-1= 10 nF
- Sensor 2 | R5-2= 400 Ohm, C5-2= 100 nF | R5-2= 4 kOhm, C5-2= 10 nF
- Sensor 3 | R6-1= 400 Ohm, C6-1= 100 nF | R6-1= 4 kOhm, C6-1= 10 nF
- Alexander Prebeck | 0.2

## Power pins joined to a net without a drawn wire
VBAT: IC1-1.1(AN_POWER:VBAT)

## Library data of the parts
C1-1-C1-3 C1-5 C2-1 C2-2 C3-2-C3-5 = resistor:C-EU: CAPACITOR, European symbol; MF: KEMET; MPN: C0805C104K1RAC AUTO; OC_FARNELL: 2070444
C1-4 = resistor:C-EU: CAPACITOR, European symbol; MF: MURATA; MPN: GRM21BR61A475KA73L; OC_FARNELL: 1845742
C1-6 C1-7 C1-10 C1-11 = resistor:C-EU: CAPACITOR, European symbol; MF: KEMET; MPN: C0805C270J5GACTU; OC_FARNELL: 1414683
C1-8 = resistor:C-EU: CAPACITOR, European symbol; MF: MURATA; MPN: GRM21BR71E105KA99L; OC_FARNELL: 1828830
C1-9 = resistor:C-EU: CAPACITOR, European symbol; MF: MULTICOMP; MPN: MC0805B103K500CT; OC_FARNELL: 1759246
C3-1 = resistor:C-EU: CAPACITOR, European symbol; MF: MURATA; MPN: GRM31CC8YA106KA12L; OC_FARNELL: 1889298
C5-1-C5-6 C6-1-C6-3 = resistor:C-EU: CAPACITOR, European symbol
D3-1 = diode:DIODE-: DIODE; MF: DIODES INC.; MPN: B360B-13-F; OC_FARNELL: 1858607
D3-2 = diode:DIODE-: DIODE; MF: MULTICOMP; MPN: SMAJ30CA; OC_FARNELL: 1578982
D3-3 = diode:DIODE-: DIODE
D5-1 D5-2 D6-1 = diode:PESD1CAN: CAN bus ESD protection diode Source: http://www.nxp.com/documents/data_sheet/PESD1CAN.pdf
DIP21 = multicomp:MULTICOMP: MULTICOMP DIP-SWITCH 8pol 1.27mm
F3-1 = fuse_smd:FUSE_1210
F3-2 = fuse:SHK20Q: FUSE HOLDER 5 x 20 mm, SH contact, E1207 Buerklin 64G6061; MF: SCHURTER; MPN: 0031.8201; OC_FARNELL: 1162740; OC_NEWARK: unknown
IC1-1 = stm32:STM32F10XRXT6: STM32F101/103 64pin LQFP
IC2-1 = MCP2551:MCP2551-E/SN: High-Speed CAN Transceiver; DESCRIPTION: High-Speed CAN Transceiver; MF: MICROCHIP; MPN: MCP2551-E/SN; OC_FARNELL: 1467746; OC_NEWARK: 92C4186; PACKAGE: SOIC-8; SUPPLIER: Microchip
IC2-2 = segger:J-LINK-10PIN-HOLES; OC_FARNELL: unknown
IC2-3 = PRTR5V0U4D:PRTR5V0U4D; MF: NXP; MPN: PRTR5V0U4D,125.; OC_FARNELL: 1757869
IC3-1 = dc-dc-converter:SIM1: Reichelt SIM1-240x SIL4; MF: XP POWER; MPN: IE2405S; OC_FARNELL: 8727805
IC3-2 = mic5209:MIC5209: The MIC5209 is an efficient linear voltage regulator with very low dropout voltage, typically 10mV at light loads and less than 500mV at full load, with better than 1% output voltage accuracy. Package by Maximilian Niedernhuber m.niedernhuber (at) draketronic.de; MF: MICREL SEMICONDUCTOR; MPN: MIC5209-3.3YS TR; OC_FARNELL: 2100322
IC5-1 IC5-2 IC6-1 = max31865ATP+:MAX31865ATP+; MANUFACTURER_NAME: Maxim; MANUFACTURER_PART_NUMBER: MAX31865ATP+; VENDOR: Maxim
JP2-1 = jumper:JP1E: JUMPER; OC_FARNELL: unknown
JP2-2 = jumper:JP4E: JUMPER; OC_FARNELL: unknown
JP3-1 = jumper:JP2E: JUMPER; OC_FARNELL: unknown
LED1-1 = led:DUOLED-RG-C: DUO LED 2 colors (red/green), 5 mm, round, common Cathode www.ligitek.com or other producers.
Q1-1 = 000_eigene_Bauteile:SMD_QUARZ_6X3.5MM
Q1-2 = 000_eigene_Bauteile:QUARZ_RTC_TH; FARNELL: 1611828
R1-1-R1-4 R2-1-R2-10 = resistor:R-EU_: RESISTOR, European symbol; OC_FARNELL: unknown
R5-1 R5-2 R6-1 = resistor:R-EU_: RESISTOR, European symbol
RTC_HOUSING_GND = testpad:TPSQ: Test pad
S1-1 = switch-omron:31-XX: OMRON SWITCH; MF: OMRON ELECTRONIC COMPONENTS; MPN: B3F-3100; OC_FARNELL: 959704; OC_NEWARK: 36M3582
SJ1 SJ2 = jumper:SJ2W: SMD solder JUMPER
SJ2-1 = jumper:SJ2W: SMD solder JUMPER; OC_FARNELL: unknown
SJ4-1-SJ4-4 = jumper:SJ: SMD solder JUMPER
T3-1 = zetex:NPNSOT323: NPN TRANSISTOR; MPN: DSS4160U-7; OC_FARNELL: 1710696; OC_NEWARK: 25R4558
TP3-1 TP3-2 TP4-1-TP4-3 = solpad:LSP10: SOLDER PAD drill 1.0 mm, distributor Buerklin, 12H555; OC_FARNELL: unknown
U4 = hutschiene_umriss:HUTSCHIENE_DEV; OC_FARNELL: unknown
U$1 = logos_neu:OTH-LOGO13X7
U$2 = 000_eigene_Bauteile:FINDER_34.51
VAR3-1-VAR3-3 = varistor:VARISTOR: VARISTOR; MF: AVX; MPN: VC121030H620DP; OC_FARNELL: 1658894

## Net classes
1 230V: clearance 1.981 mm to class 0, clearance 1.981 mm
2 24V: clearance 0.254 mm to class 0, clearance 0.254 mm to class 1, clearance 0.254 mm

## Board
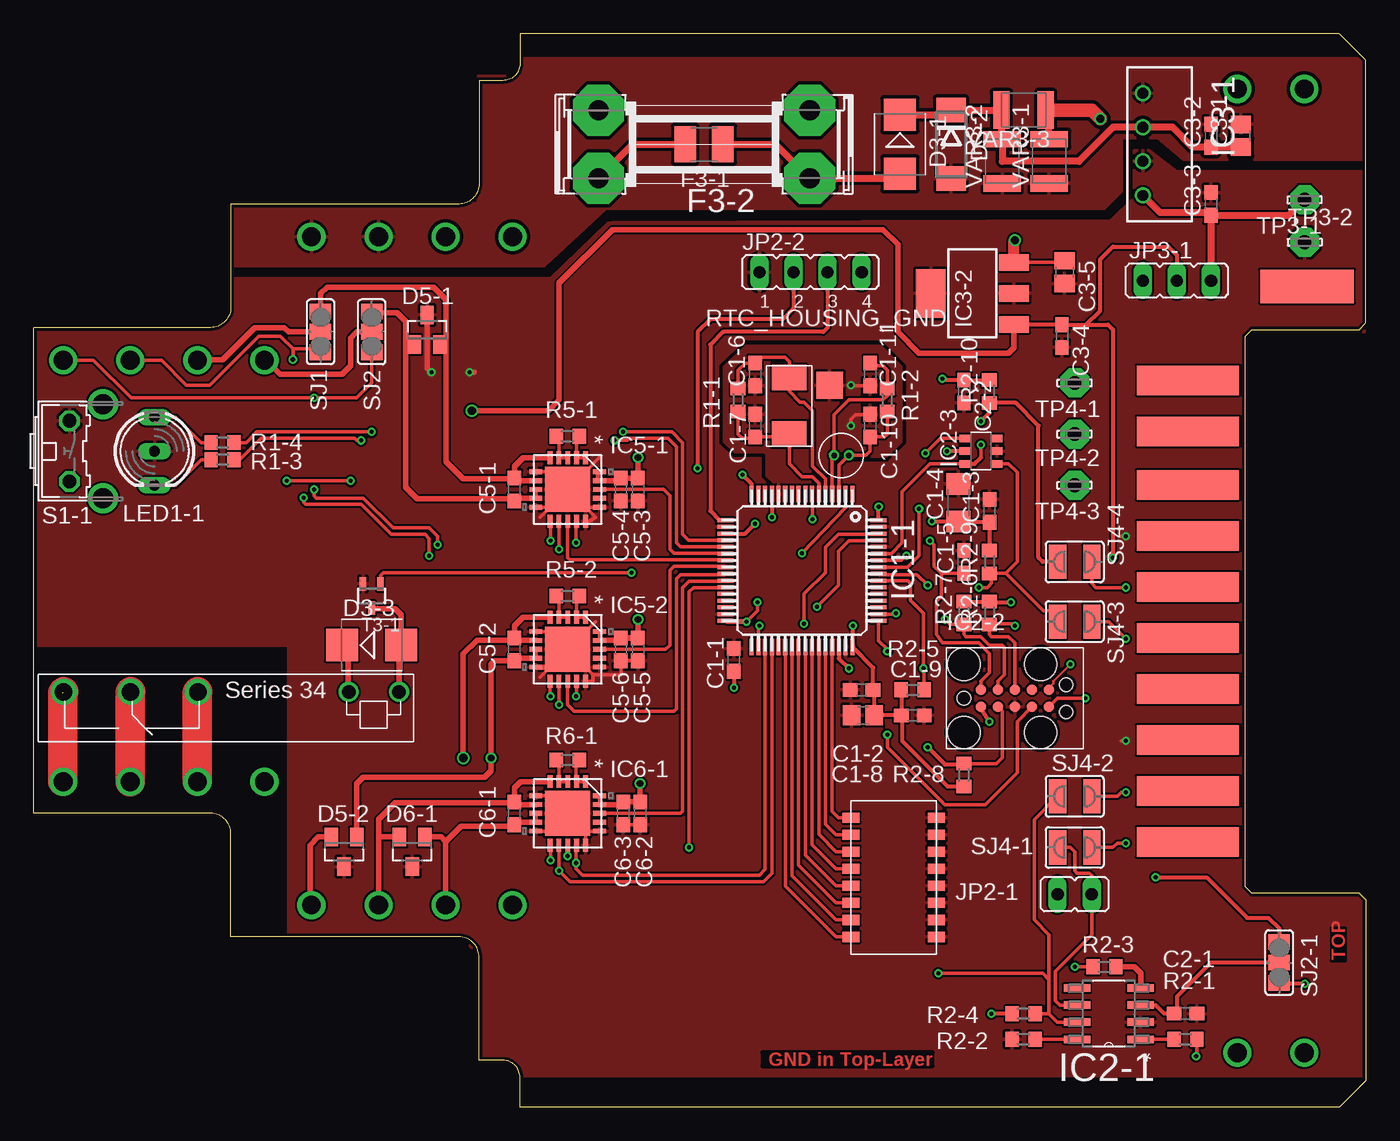
[diagram p6: board, top side]
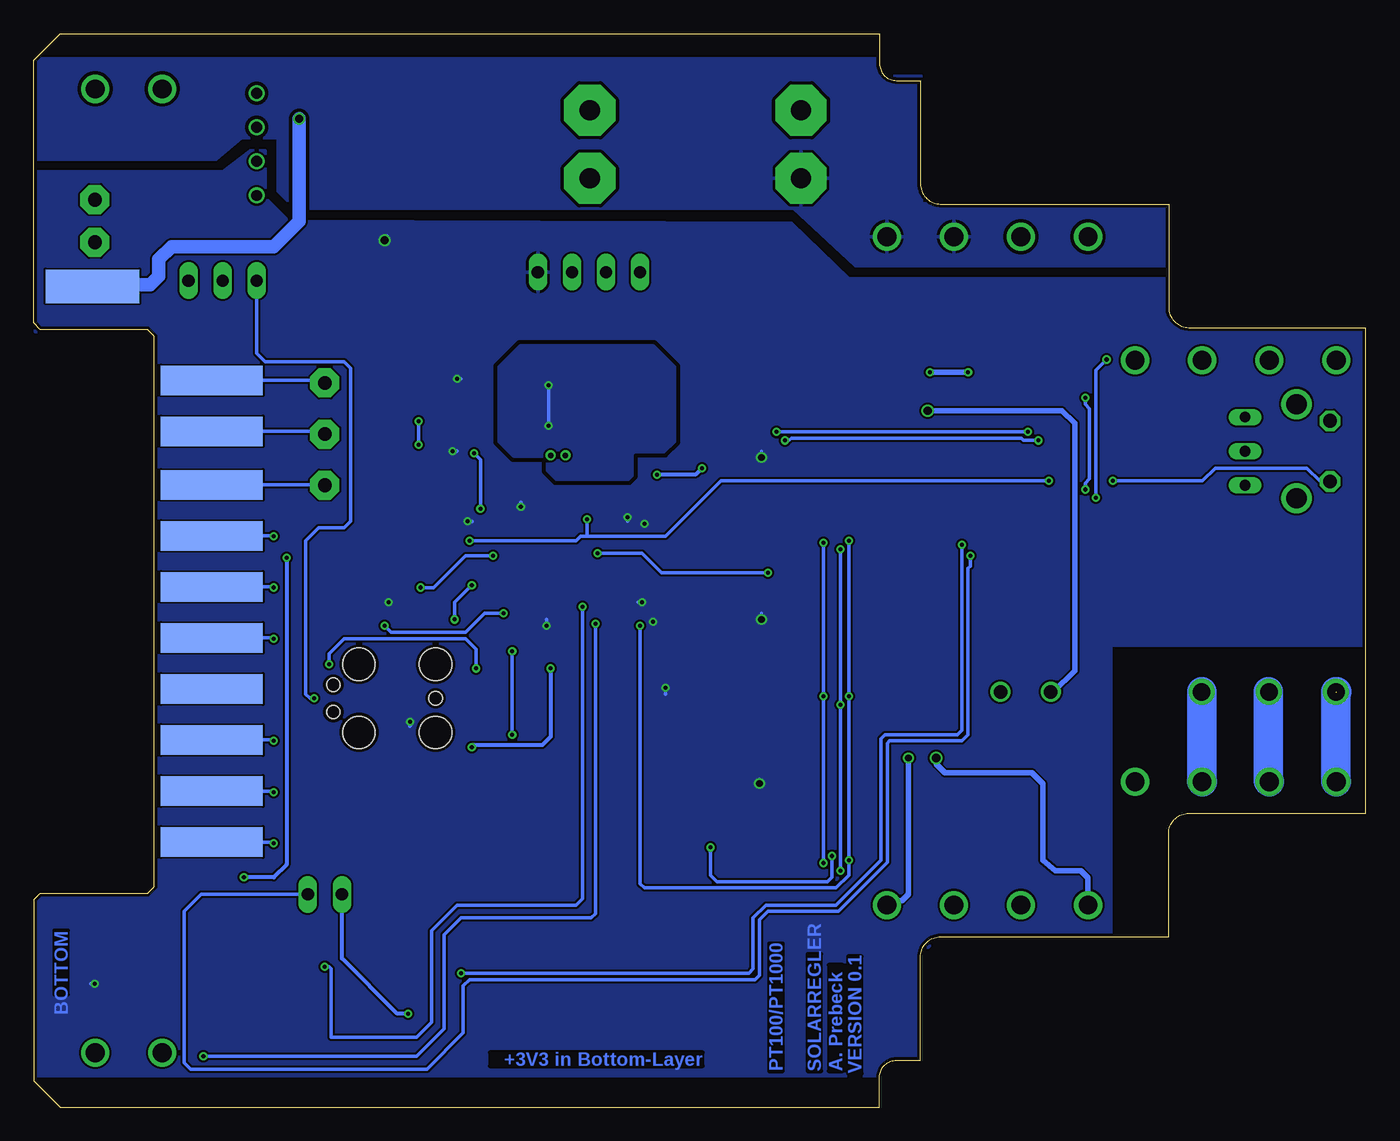
[diagram p7: board, bottom side, seen from below]

Size 99.3 x 79.99 mm. Coordinates in mm from the lower left corner, seen from the top.
Copper layers (1*16): Top 0.018mm / dielectric 1.55mm / Bottom 0.018mm
Design rules "default": minimum track width 0.15mm, minimum drill 0.3mm, track to track 0.15mm, track to pad 0.15mm, pad to pad 0.15mm, via to via 0.15mm, smd to smd 0mil, copper to edge 0.25mm, drill to drill 0.35mm, minimum pad ring 0.175mm, minimum via ring 0.15mm, stop-mask expansion 0mil, vias tented up to drill 0.45mm, thermal gap 0.2mm
tRestrict: 11 lines
bRestrict: 14 lines

### Footprints (pad centres in the part's own frame; a part is rotated, then mirrored left to right if it is on the bottom)
C0603 = smd 1.1 x 1: 1 -0.85,0; 2 0.85,0
C1206 = smd 1.6 x 1.8: 1 -1.4,0; 2 1.4,0
C0805 = smd 1.3 x 1.5: 1 -0.85,0; 2 0.85,0
SMB = smd 2.4 x 2.4: A 2.2,0; C -2.2,0
DO214AA = smd 1.8 x 2.2: A 2.55,0; C -2.55,0
SOT23 = smd 1 x 1.4: 1 -0.95,-1.1; 2 0.95,-1.1; 3 0,1.1
MULTICOMP = smd 0.76 x 1.27: P$1 0,-1.27; P$2 1.27,-1.27; P$3 2.54,-1.27; P$4 3.81,-1.27; P$5 5.08,-1.27; P$6 6.35,-1.27; P$7 7.62,-1.27; P$8 8.89,-1.27; P$9 0,-7.62; P$10 1.27,-7.62; P$11 2.54,-7.62; P$12 3.81,-7.62; P$13 5.08,-7.62; P$14 6.35,-7.62; P$15 7.62,-7.62; P$16 8.89,-7.62
1210 = smd 1.6 x 2.7: 1 -1.4,0; 2 1.4,0
SHK20Q = drill 1.5 pad 3.81 octagon: 1A -7.874,2.54; 1B -7.874,-2.54; 2A 7.874,2.54; 2B 7.874,-2.54
TQFP64 = smd 1.2 x 0.3: 1 -5.7,3.75; 2 -5.7,3.25; 3 -5.7,2.75; 4 -5.7,2.25; 5 -5.7,1.75; 6 -5.7,1.25; 7 -5.7,0.75; 8 -5.7,0.25; 9 -5.7,-0.25; 10 -5.7,-0.75; 11 -5.7,-1.25; 12 -5.7,-1.75; 13 -5.7,-2.25; 14 -5.7,-2.75; 15 -5.7,-3.25; 16 -5.7,-3.75; 33 5.7,-3.75; 34 5.7,-3.25; 35 5.7,-2.75; 36 5.7,-2.25; 37 5.7,-1.75; 38 5.7,-1.25; 39 5.7,-0.75; 40 5.7,-0.25; 41 5.7,0.25; 42 5.7,0.75; 43 5.7,1.25; 44 5.7,1.75; 45 5.7,2.25; 46 5.7,2.75; 47 5.7,3.25; 48 5.7,3.75 | smd 0.3 x 1.2: 17 -3.75,-5.7; 18 -3.25,-5.7; 19 -2.75,-5.7; 20 -2.25,-5.7; 21 -1.75,-5.7; 22 -1.25,-5.7; 23 -0.75,-5.7; 24 -0.25,-5.7; 25 0.25,-5.7; 26 0.75,-5.7; 27 1.25,-5.7; 28 1.75,-5.7; 29 2.25,-5.7; 30 2.75,-5.7; 31 3.25,-5.7; 32 3.75,-5.7; 49 3.75,5.7; 50 3.25,5.7; 51 2.75,5.7; 52 2.25,5.7; 53 1.75,5.7; 54 1.25,5.7; 55 0.75,5.7; 56 0.25,5.7; 57 -0.25,5.7; 58 -0.75,5.7; 59 -1.25,5.7; 60 -1.75,5.7; 61 -2.25,5.7; 62 -2.75,5.7; 63 -3.25,5.7; 64 -3.75,5.7
SOIC127P600X175-8N = smd 1.981 x 0.559: 1 -2.362,1.905; 2 -2.362,0.635; 3 -2.362,-0.635; 4 -2.362,-1.905; 5 2.362,-1.905; 6 2.362,-0.635; 7 2.362,0.635; 8 2.362,1.905
J-LINK-10PIN-HOLES = smd 0.8 x 0.8: 1 1.27,-0.64; 2 2.54,-0.64; 3 3.81,-0.64; 4 5.08,-0.64; 5 6.35,-0.64; 6 6.35,0.64; 7 5.08,0.64; 8 3.81,0.64; 9 2.54,0.64; 10 1.27,0.64 | hole 1: 0,0; 7.62,1.015; 7.62,-1.015 | hole 2.4: 0,2.54; 0,-2.54; 5.715,2.54; 5.715,-2.54
SC74 = smd 0.55 x 0.8: 1 -0.95,-1.2; 2 0,-1.2; 3 0.95,-1.2; 4 0.95,1.2; 5 0,1.2; 6 -0.95,1.2
4SIL = drill 0.8: 1 -3.81,0; 2 -1.27,0; 3 1.27,0; 4 3.81,0
SOT223 = smd 1.219 x 2.235: 1 -2.311,-3.099; 2 0,-3.099; 3 2.311,-3.099 | smd 3.6 x 2.2: 4 0,3.099
21-0140L_T2055-5 = smd 0.965 x 0.356: 1 -2.375,1.321; 2 -2.375,0.66; 3 -2.375,0; 4 -2.375,-0.66; 5 -2.375,-1.321; 11 2.375,-1.321; 12 2.375,-0.66; 13 2.375,0; 14 2.375,0.66; 15 2.375,1.321 | smd 0.356 x 0.965: 6 -1.321,-2.375; 7 -0.66,-2.375; 8 0,-2.375; 9 0.66,-2.375; 10 1.321,-2.375; 16 1.321,2.375; 17 0.66,2.375; 18 0,2.375; 19 -0.66,2.375; 20 -1.321,2.375 | smd 3.353 x 3.353: 21 0,0
JP1 = drill 0.914 long: 1 0,-1.27; 2 0,1.27
JP4 = drill 0.914 long: 1 -3.81,0; 2 -1.27,0; 3 1.27,0; 4 3.81,0
JP2 = drill 0.914 long: 1 -2.54,0; 2 0,0; 3 2.54,0
DUOLED-C-5MM = drill 0.813 long: AR 2.54,0; AX -2.54,0; C 0,0
SMD_QUARZ_6X3.5MM = smd 1.9 x 2.6: 1 0,0; 2 4.2,0
THROUGH_HOLE_QUARZ_RTC = drill 0.4: P$1 0,0; P$2 1.1,0
R0603 = smd 1 x 1.1: 1 -0.85,0; 2 0.85,0
TP20SQ = smd 2 x 2: TP 0,0
B3F-31XX = drill 1.016 octagon: 1 -2.261,-1.245; 2 2.261,-1.245 | drill 1.499 pad 2.159: 3 -3.505,1.245; 4 3.505,1.245
SJ_2 = smd 1.168 x 1.6: 1 -1.524,0; 2 0,0; 3 1.524,0
SJW = smd 1.27 x 2.54: 1 -1.27,0; 2 1.27,0
SOT323 = smd 0.5 x 1: 1 0,0.9; 2 -0.65,-0.9; 3 0.65,-0.9
LSP10 = drill 1.016 pad 2.159 octagon: MP 0,0
HUTSCHIENE = drill 1.4: 1 62.2,64.3; 2 67.2,64.3; 3 72.2,64.3; 4 77.2,64.3; 5 80.7,55.1; 6 85.7,55.1; 7 90.7,55.1; 8 95.7,55.1; 9 95.7,23.7; 10 90.7,23.7; 11 85.7,23.7; 12 80.7,23.7; 13 77.2,14.5; 14 72.2,14.5; 15 67.2,14.5; 16 62.2,14.5; 18 3.2,3.5; 19 8.2,3.5; 20 3.2,75.3; 21 8.2,75.3 | smd 7.6 x 2.2: 17 11.9,59.6; 22 11.9,55.8; 23 11.9,52; 24 11.9,48.2; 25 11.9,44.4; 26 11.9,40.6; 27 11.9,36.8; 28 11.9,33; 29 11.9,29; 30 11.9,25.2 | smd 7.6 x 2.2 bottom: 31 11.9,59.6; 32 11.9,55.8; 33 11.9,52; 34 11.9,48.2; 35 11.9,44.4; 36 11.9,40.6; 37 11.9,36.8; 38 11.9,33; 39 11.9,29; 40 11.9,25.2 | smd 7 x 2.5 bottom: 41 3,18.2 | smd 7 x 2.5: 42 3,18.2
SERIES_34 = drill 1.3 pad 1.676: 11 18.6,-2.7; 12 13.6,-2.7; 14 23.6,-2.7 | drill 1 pad 1.422: A1 2.35,-2.7; A2 -1.4,-2.7
CT/CN1210 = smd 1.2 x 2.8: 1 -1.65,0; 2 1.65,0

### Placement (x,y rotation side)
C1-1  52.19,33.32 90 top
C1-2  61.72,31.1 180 top
C1-3  71.24,44.44 90 top
C1-4  68.94,45.04 90 top
C1-5  69.34,40.63 90 top
C1-6  53.78,54.6 90 top
C1-7  53.78,50.79 270 top
C1-8  61.81,29.2 180 top
C1-9  65.53,29.2 0 top
C1-10  62.35,50.79 270 top
C1-11  62.35,54.6 90 top
C2-1  85.84,6.97 0 top
C2-2  69.34,53.33 270 top
C3-1  89.97,72.38 90 top
C3-2  87.75,72.38 90 top
C3-3  87.75,67.3 90 top
C3-4  76.64,57.45 270 top
C3-5  76.84,62.22 270 top
C5-1  35.84,46.02 90 top
C5-2  35.84,34.12 90 top
C5-3  45.05,46.02 270 top
C5-4  43.78,46.02 270 top
C5-5  45.05,34.12 270 top
C5-6  43.78,34.12 270 top
C6-1  35.84,21.89 90 top
C6-2  45.2,21.89 270 top
C6-3  43.94,21.89 270 top
D3-1  64.57,71.74 270 top
D3-2  68.38,71.74 270 top
D3-3  25.2,34.43 0 top
D5-1  29.33,57.93 0 top
D5-2  23.14,19.04 180 top
D6-1  28.22,19.04 180 top
DIP21  59.65,12.69 90 top
F3-1  49.97,71.74 180 top
F3-2  49.97,71.74 180 top
IC1-1  57.27,39.99 270 top
IC2-1  80.13,6.97 180 top
IC2-2  69.34,30.47 0 top
IC2-3  70.61,48.88 90 top
IC3-1  82.67,71.74 270 top
IC3-2  69.97,60.63 90 top
IC5-1  39.81,46.02 270 top
IC5-2  39.81,34.12 270 top
IC6-1  39.81,21.89 270 top
JP2-1  77.59,15.86 270 top
JP2-2  57.91,62.22 0 top
JP3-1  85.21,61.58 0 top
LED1-1  9.01,48.88 270 top
Q1-1  56.32,50.15 90 top
Q1-2  60.76,48.56 180 top
R1-1  52.51,52.69 90 top
R1-2  63.62,52.69 270 top
R1-3  14.09,48.25 180 top
R1-4  14.09,49.52 180 top
R2-1  85.84,5.07 0 top
R2-2  73.78,5.07 180 top
R2-3  79.81,10.46 0 top
R2-4  73.78,6.97 0 top
R2-5  65.53,31.1 180 top
R2-6  71.24,36.82 90 top
R2-7  69.34,36.82 90 top
R2-8  69.34,24.75 270 top
R2-9  71.24,40.63 90 top
R2-10  71.24,53.33 90 top
R5-1  39.81,49.99 0 top
R5-2  39.81,38.09 0 top
R6-1  39.81,25.86 0 top
RTC_HOUSING_GND  59.33,53.8 0 top
S1-1  3.93,48.88 270 top
SJ1  21.39,57.77 90 top
SJ2  25.2,57.77 90 top
SJ2-1  92.83,10.78 270 top
SJ4-1  77.59,19.35 180 top
SJ4-2  77.59,23.16 180 top
SJ4-3  77.59,36.18 180 top
SJ4-4  77.59,40.63 180 top
T3-1  25.2,38.09 180 top
TP3-1  94.73,67.61 180 top
TP3-2  94.73,64.44 0 top
TP4-1  77.59,53.96 180 top
TP4-2  77.59,50.15 180 top
TP4-3  77.59,46.34 180 top
U4  97.91,79.36 180 top
U$1  43.94,2.21 90 top
U$2  25.84,28.24 180 top
VAR3-1  75.69,70.47 90 top
VAR3-2  72.19,70.47 90 top
VAR3-3  73.78,74.28 180 top

### Tracks (layer width: path | path; a pad name or v marks a point on that pad's centre or on a via)
+3V3  (via drill 0.3, 0.5, 0.6)
  Top 0.254: 62.67,31 C1-2.1 | 94.67,9.26 v94.73,9.19 | IC3-2.3 76.71,62.94 C3-5.1 | 67.85,54.18 v67.75,54.28 | 71.19,43.64 C1-3.1 | IC5-1.20 42.08,47.34 42.03,47.29 | 42.03,46.84 IC5-1.19 | IC1-1.13 55.05,45.66 | IC1-1.19 51.62,42.74 | 51.63,36.18 IC1-1.32 53.08,36.24 | IC1-1.48 61.08,34.35 | C1-9.1 64.73,29.14 | C5-6.1 43.83,34.91 | 45.2,34.91 45.05,34.91 | 53.08,36.24 v53.14,36.18 | 43.59,46.68 C5-4.1 | 53.08,36.24 53.2,36.24 53.94,36.97 v53.94,37.61
  Top 0.305: R2-5.2 C1-9.1 C1-8.1 62.67,31 | C1-2.1 62.56,32.75 IC1-1.48 | SJ2-1.3 94.67,9.26 | R2-10.2 C2-2.1 67.85,54.18 | 71.19,43.64 C1-4.1 v66.96,43.64 v66.95,43.64 | C1-3.1 R2-9.2 | R2-7.2 R2-6.2 71.24,37.61 v72.83,37.61 | 42.03,47.29 42.03,46.84 | IC6-1.20 IC6-1.19 | IC5-2.20 IC5-2.19 | 55.05,45.66 v55.05,43.96 | 51.62,42.74 53.03,42.74 v53.78,43.48 | C1-1.1 v52.19,31.26 | 51.63,36.18 v53.14,36.18 | 61.08,34.35 v61.08,35.86 | 64.73,29.14 64.73,27.29 68.12,23.9 R2-8.2 | 43.83,34.91 45.05,34.91 | IC2-2.1 70.61,29.67 v71.24,28.72 | 73.07,64.52 v73.14,64.6 | IC2-3.5 v68.06,48.88 | IC1-1.64 62.98,43.76 v62.98,44.75
  Top 0.406: C5-4.1 C5-3.1 v45.05,48.4 | C5-5.1 C5-6.1 43.59,34.78 IC5-2.19 | 45.05,34.91 v45.05,36.34 | v45.2,24.12 C6-2.1 C6-3.1 43.94,22.55 IC6-1.19 | IC5-1.19 43.59,46.68
  Top 0.813: IC3-2.3 73.07,64.52
  Bottom 0.254: v94.73,9.19 95.05,9.19 | v67.75,54.28 67.43,54.28 | v45.05,48.4 45.05,48.88 | v55.05,43.96 55.05,43.64 | v52.19,31.26 52.19,30.78 | v61.08,35.86 61.08,36.34 | v45.05,36.34 45.05,36.82 | v45.2,24.12 45.2,24.43 | v53.94,37.61 54.25,37.61
  Bottom 0.305: v71.24,28.72 71.24,28.4 | v73.14,64.6 73.14,64.76 72.99,64.91 | v68.06,48.88 67.75,48.88 | v66.95,43.64 66.64,43.64 | v72.83,37.61 72.99,37.61 | v62.98,44.75 62.98,45.07
  pour Bottom (rank 2): 14.73,61.74 38.54,61.74 42.82,65.87 80.29,66.03 82.03,67.77 82.03,71.26 83.15,71.26 85.21,69.68 99.18,69.68 99.18,57.77 90.92,57.77 90.29,57.14 90.29,16.5 90.92,15.86 99.18,15.86 99.18,1.89 97.28,-0.01 36.32,-0.01 36.32,2.53 35.05,3.8 33.14,3.8 33.14,11.42 31.87,12.69 19.01,12.69 19.01,34.43 0.12,34.43 0.12,57.77 13.46,57.77 14.73,59.04
+5V  (via drill 0.3, 0.6)
  Top 0.152: D3-3.C 23.46,33.98 23.46,33.96
  Top 0.254: 73.08,58.3 IC3-2.1
  Top 0.305: 73.08,58.3 C3-4.1 78.44,58.3 | 78.44,58.3 79.5,59.36 79.5,63.17 80.45,64.12 84.58,64.12 85.21,63.49 JP3-1.2 | 78.44,58.3 80.07,58.3 80.45,57.93 v80.45,40.94 | v83.62,17.13 87.43,17.13 90.45,14.11 92.04,14.11 92.83,13.32 SJ2-1.1
  Top 0.406: IC3-2.1 73.07,56.58 72.67,56.18 66,56.18 64.41,57.77 64.41,64.28 63.3,65.39 43.14,65.39 39.17,61.42 39.17,52.69 38.38,51.9 v32.66,51.9 | U$2.A1 23.46,30.97 23.46,33.96
  Bottom 0.305: v80.45,40.94 80.45,18.08 81.4,17.13 v83.62,17.13
  Bottom 0.406: v32.66,51.9 22.66,51.9 21.71,50.94 21.71,32.53 23.3,30.94 U$2.A1
+24V
  Top 0.508: D3-1.C 68.03,73.94 D3-2.C VAR3-3.2 72.13,72.18 VAR3-2.2 72.19,70.47 77.91,70.47 80.45,73.01 IC3-1.2 84.89,73.01 86.38,71.53 C3-2.1 C3-1.1
C0
  Top 0.254: IC1-1.45 59.49,34.29 59.49,22.05 59.97,21.58 DIP21.P$8
C1
  Top 0.254: DIP21.P$7 59.81,20.31 59.02,21.1 IC1-1.44
C2
  Top 0.254: IC1-1.43 58.52,20.33 59.81,19.04 DIP21.P$6
C3
  Top 0.254: IC1-1.42 58.02,19.56 59.81,17.77 DIP21.P$5
C4
  Top 0.254: IC1-1.41 57.52,18.79 59.81,16.5 DIP21.P$4
C5
  Top 0.254: IC1-1.40 57.02,18.02 59.81,15.23 DIP21.P$3
C6
  Top 0.254: IC1-1.39 56.52,17.25 59.81,13.96 DIP21.P$2
C7
  Top 0.254: IC1-1.38 56.02,16.48 59.81,12.69 DIP21.P$1
CAN_RX  (via drill 0.3)
  Top 0.254: R2-3.1 v77.59,10.46 | IC1-1.61 62.94,42.21 60.76,42.21 59.97,41.42 59.97,38.88 v58.38,37.29
  Bottom 0.254: v77.59,10.46 77.27,10.46 77.11,10.3 77.11,5.22 70.76,5.22 69.65,6.34 69.65,13.16 67.75,15.07 58.86,15.07 58.38,15.54 v58.38,37.29
CAN_TERM2  (via drill 0.3)
  Top 0.305: R2-4.1 v71.4,6.97
  Bottom 0.305: v71.4,6.97 72.19,6.97 76.32,11.1 JP2-1.1
CAN_TX  (via drill 0.3)
  Top 0.254: R2-1.2 86.7,3.85 v86.64,3.8 | v57.43,36.02 57.43,38.24 59.02,39.83 59.02,41.74 59.97,42.69 62.92,42.69 IC1-1.62
  Bottom 0.254: v86.64,3.8 70.76,3.8 68.7,5.86 68.7,12.84 67.43,14.11 57.75,14.11 57.43,14.43 v57.43,36.02
CANH  (via drill 0.3)
  Top 0.254: IC2-1.7 76.32,6.34 75.69,6.97 | 75.69,6.97 R2-4.2 | U4.9 4.45,55.66 7.26,52.85 v20.92,52.85 24.09,52.85 25.2,53.96 SJ2.1 | 75.69,6.97 75.69,9.51 | 75.69,9.51 75.69,12.84 74.57,13.96 74.57,21.42 SJ4-2.2 | v67.43,9.99 75.21,9.99 75.69,9.51 | v20.92,46.02 20.92,45.55 21.08,45.39 24.57,45.39 26.79,43.17 29.49,43.17 30.12,42.53 v30.12,41.9
  Bottom 0.254: v20.92,52.85 20.92,52.37 20.6,52.06 20.6,46.82 20.92,46.5 v20.92,46.02 | v30.12,41.9 30.12,28.08 30.44,27.77 35.84,27.77 36.16,27.45 36.16,18.4 39.49,15.07 44.73,15.07 45.68,14.11 45.68,10.3 46,9.99 v67.43,9.99
CANL  (via drill 0.3)
  Top 0.254: SJ4-1.2 77.27,19.35 77.59,19.04 77.59,17.61 77.75,17.45 78.7,17.45 78.86,17.29 JP2-1.2 78.86,12.84 76.16,10.15 76.16,7.92 76.48,7.61 IC2-1.6 | U4.10 9.53,55.66 11.39,53.8 13.14,53.8 16.79,57.45 18.38,57.45 19.33,56.5 | 21.3,56.34 SJ1.1 21.14,56.5 19.33,56.5 | 19.33,56.5 v19.33,55.71 | v20.12,45.42 20.12,45.08 20.28,44.91 24.41,44.91 26.63,42.69 29.17,42.69 29.49,42.37 v29.49,41.1
  Bottom 0.254: v19.33,55.71 20.12,54.91 20.12,51.1 | 20.12,51.1 20.14,51.1 | v29.49,41.1 29.49,40.31 29.65,40.15 29.65,27.77 30.12,27.29 35.52,27.29 35.68,27.13 35.68,18.24 39.33,14.59 44.57,14.59 45.2,13.96 45.2,9.83 45.52,9.51 66.8,9.51 67.27,9.03 67.27,5.54 69.97,2.84 87.59,2.84 88.07,3.32 88.07,14.59 86.8,15.86 JP2-1.2 | v20.12,45.42 20.12,50.62 20.12,51.1
CS_1
  Top 0.254: IC5-1.13 39.81,40.94 39.97,40.78 51.53,40.78 IC1-1.23
CS_2
  Top 0.254: IC5-2.13 39.81,29.99 40.28,29.51 47.75,29.51 47.9,29.67 47.9,39.36 48.22,39.67 51.5,39.67 IC1-1.25
CS_3  (via drill 0.3)
  Top 0.254: IC6-1.13 v39.81,18.72 | v48.86,19.35 48.86,38.4 49.17,38.72 51.55,38.72 IC1-1.27
  Bottom 0.254: v39.81,18.72 39.81,17.13 40.12,16.81 48.38,16.81 48.86,17.29 v48.86,19.35
DRDY_1
  Top 0.254: IC5-1.18 46.95,46.02 47.43,45.55 47.43,41.58 47.75,41.26 51.55,41.26 IC1-1.22
DRDY_2
  Top 0.254: IC5-2.18 47.11,34.12 47.43,34.43 47.43,39.99 47.75,40.31 51.5,40.31 IC1-1.24
DRDY_3
  Top 0.254: IC6-1.18 48.22,21.89 48.38,22.05 48.38,38.72 48.86,39.2 51.53,39.2 IC1-1.26
GND  (via drill 0.3)
  Top 0.254: v81.4,42.53 81.08,42.53 | v81.4,27.29 81.08,27.29 | 40.2,33.72 IC5-2.21 38.49,35.44 IC5-2.6 | 40.2,33.72 41.08,32.85 | IC5-2.15 41.55,31.74 41.71,31.74 41.71,32.21 | IC5-1.21 41.87,43.96 41.39,43.65 IC5-1.15 | 41.13,20.57 IC6-1.10 | IC6-1.16 41.13,20.57 | 41.13,20.57 IC6-1.21 38.49,23.21 IC6-1.6 | IC5-1.21 38.49,47.34 IC5-1.6 41.13,47.34 | C1-11.1 60.98,53.75 v60.92,53.8 | v60.92,50.79 60.92,51.26 61.24,51.58 62.29,51.58 C1-10.1 | C6-2.2 C6-3.2 | IC6-1.15 41.13,20.57 | 37.74,32.05 38.54,32.85 38.86,32.85 39.33,32.85 40.2,33.72 | IC5-1.10 38.27,44.7 38.38,44.59 | 38.38,44.59 37.74,43.96 | 38.38,44.59 IC5-1.21 | 41.13,47.34 41.17,47.34 41.17,44.69 IC5-1.16 | 41.13,47.34 42.31,48.52 | C5-6.2 43.78,33.32 C5-5.2 C5-6.2 | C5-6.2 43.78,32.21 41.71,32.21 | 41.71,32.21 41.08,32.85 | 41.08,32.85 41.08,35.55 41.24,35.55 41.87,36.18
  Top 0.406: IC5-2.10 38.8,32.8 38.86,32.85 | D5-1.3 29.33,55.07 v29.65,54.75 | v32.51,54.75 32.82,54.75 | T3-1.3 24.57,39.14 24.57,39.04
  Bottom 0.254: U4.37 81.4,42.56 v81.4,42.53 | U4.33 81.4,27.36 v81.4,27.29 | v60.92,53.8 v60.92,50.79
  Bottom 0.406: v29.65,54.75 v32.51,54.75
  pour Top: 43.12,65.88 80.3,66.04 82.03,67.77 82.03,71.26 83.15,71.26 85.21,69.68 99.18,69.68 99.18,57.77 90.92,57.77 90.29,57.14 90.29,16.5 90.92,15.86 99.18,15.86 99.18,1.89 97.28,-0.01 36.32,-0.01 36.32,2.53 35.05,3.8 33.14,3.8 33.14,11.42 31.87,12.69 19.01,12.69 19.01,34.43 0.12,34.43 0.12,57.77 13.46,57.77 14.73,59.04 14.73,61.74 38.54,61.74 42.82,65.87
  pour Bottom: 51.4,55.07 53.14,56.82 62.98,56.82 64.73,55.07 64.73,49.67 64.73,49.52 63.62,48.4 61.4,48.4 61.24,48.25 61.24,47.45 60.45,46.66 55.05,46.66 54.89,46.66 54.57,46.98 54.57,48.56 54.41,48.72 52.35,48.72 52.19,48.72 51.4,49.52
GND1
  pour Top: 36.32,80 97.28,80 99.18,78.09 99.18,70.63 85.69,70.63 83.78,72.22 81.08,72.22 81.08,68.25 79.81,66.98 42.67,66.98 38.06,62.69 14.73,62.69 14.73,67.3 33.14,67.3 33.14,76.82 36.32,76.82
I2C1_SCL  (via drill 0.3)
  Top 0.152: 75.69,36.97 76.32,36.34 SJ4-3.2
  Top 0.254: 72.45,39.78 73.3,40.63 73.3,47.29 72.67,47.93 IC2-3.1 | 72.45,39.78 R2-9.1 71.4,39.62 71.4,39.04 71.08,38.72 v70.45,38.72 | IC1-1.58 64.69,40.74 v65.05,41.1 | 72.45,39.78 75.26,36.97 75.69,36.97
  Bottom 0.254: v65.05,41.1 67.11,41.1 69.49,38.72 v70.45,38.72
I2C1_SDA  (via drill 0.3)
  Top 0.254: IC1-1.59 63.92,41.24 64.73,42.05 64.73,45.86 66.8,47.93 IC2-3.6 | v70.61,49.36 70.61,48.4
  Top 0.305: SJ4-4.2 75.21,40.63 74.89,40.94 74.89,50.79 73.2,52.48 R2-10.1 71.24,51.74 v70.61,51.1 | IC2-3.6 70.13,47.93 70.61,48.4
  Bottom 0.254: v70.61,51.1 v70.61,49.36
I2C1_SMBA  (via drill 0.3)
  Top 0.254: IC1-1.57 65.14,40.24 66,41.1 v66,44.59 | v66.48,48.72 67.59,49.83 IC2-3.4
  Bottom 0.254: v66,44.59 66,48.25 v66.48,48.72
JTAG_SUPPLY  (via drill 0.3)
  Top 0.254: IC2-2.5 76.31,30.46 76.64,30.47 v78.38,30.47
  Bottom 0.254: v78.38,30.47 78.7,30.47 79.02,30.78 79.02,42.21 78.07,43.17 76.16,43.17 75.69,43.64 75.69,55.07 76.16,55.55 82.03,55.55 82.67,56.18 JP3-1.1
JTAG_TCK  (via drill 0.3)
  Top 0.254: IC2-2.4 73.3,28.72 73.3,24.91 70.92,22.53 67.91,22.53 63.62,26.81 v63.62,27.77 | IC1-1.49 62.97,34.77 63.62,34.12 v63.62,33.96
  Bottom 0.254: v63.62,33.96 v63.62,27.77
JTAG_TDI  (via drill 0.3)
  Top 0.254: IC2-2.8 73.14,34.59 72.67,35.07 71.4,35.07 71.24,35.23 R2-6.1 71.3,36.02 72.99,36.02 v73.14,35.86 | IC1-1.50 64.18,36.74 v64.26,36.82
  Bottom 0.254: v64.26,36.82 65.68,36.82 67.11,35.39 72.67,35.39 v73.14,35.86
JTAG_TDO  (via drill 0.3)
  Top 0.203: IC2-2.6 75.69,31.26 76,31.58 76,31.74 v77.27,33.01
  Top 0.254: IC2-2.6 | R2-5.1 66.38,32.63 v66.32,32.69 66.32,36.82 65.37,37.77 65.37,39.04 65.16,39.24 IC1-1.55
  Bottom 0.203: v77.27,33.01 77.43,33.01
  Bottom 0.254: v66.32,32.69 66.32,34.12 67.11,34.91 76.16,34.91 77.27,33.8 v77.27,33.01
JTAG_TMS  (via drill 0.3)
  Top 0.254: IC2-2.2 72.19,29.51 72.19,26.02 71.77,25.6 R2-8.1
  Top 0.305: IC1-1.46 60.02,33.43 v60.76,32.69 | v66.64,26.81 67.91,25.54 69.28,25.54 R2-8.1
  Bottom 0.305: v60.76,32.69 60.76,27.61 61.4,26.97 66.48,26.97 v66.64,26.81
JTAG_TRST  (via drill 0.3)
  Top 0.254: IC2-2.9 71.88,31.74 72.35,32.21 72.35,34.28 72.19,34.43 71.24,34.43 70.61,35.07 69.49,35.07 69.34,35.23 R2-7.1 68.28,35.97 v67.91,36.34 | v66.64,38.88 65.84,39.67 63.04,39.67 IC1-1.56
  Bottom 0.254: v67.91,36.34 67.91,37.61 v66.64,38.88
LED1  (via drill 0.3)
  Top 0.254: IC1-1.21 48.22,41.74 47.9,42.05 47.9,49.2 47.27,49.83 44.41,49.83 44.25,49.67 v43.3,49.67 | 14.88,48.25 R1-3.1 15.36,48.25 16.95,49.83 23.93,49.83 24.09,49.67 v24.41,49.67
  Bottom 0.254: v24.41,49.67 25.52,49.67 25.68,49.83 42.82,49.83 42.98,49.67 v43.3,49.67
LED2  (via drill 0.3)
  Top 0.254: IC1-1.20 48.83,42.24 48.38,42.69 48.38,49.52 47.59,50.31 v43.94,50.31 | R1-4.1 15.84,49.52 16.63,50.31 v25.2,50.31
  Bottom 0.254: v25.2,50.31 v43.94,50.31
N$1
  Top 0.254: IC5-1.1 IC5-1.2 40.47,49.8 R5-1.2
N$2
  Top 0.254: IC5-1.3 IC5-1.4 39.15,49.8 R5-1.1
N$3
  Top 0.254: IC5-2.1 IC5-2.2 40.47,37.9 R5-2.2
N$4
  Top 0.254: R1-4.2 12.5,49.52 10.6,51.42 LED1-1.AX
N$5
  Top 0.406: R2-3.2 82.03,10.46 82.51,9.99 82.51,8.89 IC2-1.4
N$6
  Top 0.254: IC5-2.3 IC5-2.4 39.15,37.9 R5-2.1
N$8
  Top 0.254: IC2-1.1 R2-1.1
N$9
  Top 0.254: R2-2.1 IC2-1.8
N$10
  Top 0.406: T3-1.1 25.26,37.13 26.95,37.13 27.4,36.68 D3-3.A 27.24,34.27 U$2.A2
N$11
  Top 0.406: SJ1.2 19.01,57.77 18.69,58.09 16.47,58.09 14.09,55.71 12.26,55.71 U4.11
N$12
  Top 0.406: SJ2.2 24.09,57.77 23.62,57.29 23.62,55.23 22.98,54.6 18.38,54.6 17.31,55.66 U4.12
N$13
  Top 0.254: R1-3.2 12.5,48.25 10.6,46.34 LED1-1.AR
N$14
  Top 0.254: IC6-1.2 IC6-1.1 40.45,24.27 40.44,24.27 40.44,25.65 R6-1.2
N$15
  Top 0.254: IC6-1.4 IC6-1.3 39.18,24.27 39.17,24.27 39.17,25.65 R6-1.1
N$17
  Top 0.508: IC3-1.4 83.94,66.66 87.53,66.66 C3-3.1 | C3-3.1 93.57,66.45 TP3-1.MP | C3-3.1 JP3-1.3
N$18  (via drill 0.3)
  Top 0.254: v81.4,19.67 80.77,19.67 80.45,19.35 SJ4-1.1
  Bottom 0.254: U4.31 81.49,19.76 v81.4,19.67
N$19
  Top 0.508: F3-1.1 55.3,71.74 F3-2.1A 64.23,69.2 D3-1.A
N$20  (via drill 0.3)
  Top 0.254: v81.4,23.48 81.08,23.48 80.77,23.16 SJ4-2.1
  Bottom 0.254: U4.32 81.48,23.56 v81.4,23.48
N$21
  Top 0.254: 85.21,7.19 C2-1.1
  Top 0.305: C2-1.1 84.26,6.97 83.62,7.61 IC2-1.3 | SJ2-1.2 87.75,10.78 85.21,8.24 85.21,7.19
N$22  (via drill 0.3)
  Top 0.254: v81.4,34.91 80.13,36.18 SJ4-3.1
  Bottom 0.254: U4.35 81.45,34.96 v81.4,34.91
N$23  (via drill 0.3)
  Top 0.254: v81.4,38.72 79.18,38.72 78.86,39.04 SJ4-4.1
  Bottom 0.254: U4.36 81.44,38.76 v81.4,38.72
N$24
  Top 0.254: R1-1.1 52.51,50.15 52.83,49.83 53.67,49.83 C1-7.2 56.1,49.94 Q1-1.1 56.32,47.93 57.27,46.98 58.06,46.98 58.54,46.5 58.54,45.71 IC1-1.6
N$29
  Top 0.254: R1-1.2 52.51,54.91 53.04,55.45 C1-6.2 54.2,55.87 56,55.87 56.32,55.55 Q1-1.2 56.32,53.33 57.11,52.53 57.43,52.53 58.06,51.9 58.06,47.77 59.02,46.82 IC1-1.5
N$77
  Bottom 0.254: U4.38 77.61,46.36 TP4-3.MP
N$78
  Bottom 0.254: U4.39 77.8,50.36 TP4-2.MP
N$79
  Bottom 0.254: U4.40 77.79,54.16 TP4-1.MP
NRST  (via drill 0.3)
  Top 0.254: IC1-1.7 58.06,45.65 v58.06,43.8 | IC2-2.10 70.61,31.74 71.24,32.37 71.24,33.8 70.45,34.59 67.75,34.59 67.27,35.23 67.27,37.71 67.64,38.09 67.64,39.78 | C1-5.1 67.64,39.78 | 67.64,39.78 67.11,40.31 67.11,41.9 v66.8,42.21 | v18.85,46.66 v23.62,46.66
  Bottom 0.254: v66.8,42.21 58.86,42.21 58.54,42.53 58.06,42.53 | S1-1.2 3.42,46.62 4.41,47.61 11.23,47.61 12.19,46.66 v18.85,46.66 | v23.62,46.66 48.06,46.66 52.19,42.53 58.06,42.53 | v58.06,43.8 58.06,42.53
OSC32_IN
  Top 0.254: IC1-1.3 60.02,47.82 Q1-2.P$1 62.03,48.56 62.35,48.88 C1-10.2 63.41,49.94 63.62,50.15 R1-2.2
OSC32_OUT
  Top 0.254: IC1-1.4 59.52,48.42 Q1-2.P$2 59.66,51.59 60.76,52.69 63.3,52.69 63.62,53.01 R1-2.1 63.62,54.91 63.3,55.23 62.56,55.23 C1-11.2
PE  (via drill 0.6)
  Top 0.508: VAR3-1.2 75.69,74.03 VAR3-3.1
  Top 1.016: v79.5,73.65 78.86,74.28 VAR3-3.1
  Bottom 1.016: U4.41 94.91,61.26 90.61,61.26 89.97,61.9 89.97,63.17 89.02,64.12 81.4,64.12 79.5,66.03 v79.5,73.65
RELAIS_COM
  Top 2.184: U$2.11 7.21,30.92 U4.7
  Bottom 2.184: U4.7 7.26,24.31 7.26,30.94
RELAIS_NC
  Top 2.184: U$2.12 12.19,30.89 12.19,24.27
  Bottom 2.184: U4.6 12.24,24.29 U$2.12
RELAIS_NO  (1 unrouted)
  Top 2.184: U$2.14 2.18,30.89 2.18,24.27
  Bottom 2.184: 2.18,30.95 2.21,30.93 | U4.8 2.24,24.29 U$2.14
RELAIS_ON  (via drill 0.3)
  Top 0.254: v44.57,39.83 26.06,39.83 25.85,39.62 T3-1.2 | v57.27,41.26 60.52,44.67 60.52,45.46 IC1-1.2
  Bottom 0.254: v44.57,39.83 52.51,39.83 53.94,41.26 v57.27,41.26
RTD1+
  Top 0.254: IC5-1.5 38.49,48.51 38.54,48.56
  Top 0.406: SJ1.3 21.39,60.63 21.87,61.1 29.81,61.1 30.76,60.15 30.76,56.82 | 30.76,56.82 30.76,48.09 32.03,46.82 35.74,46.82 C5-1.2 | D5-1.2 30.75,56.83 30.76,56.82 | IC5-1.7 36.03,46.68 C5-1.2 | IC5-1.5 36.47,48.4 35.84,47.77 C5-1.2
RTD1-
  Top 0.254: IC5-1.8 IC5-1.9
  Top 0.406: 27.74,56.66 27.74,46.18 28.59,45.33 35.84,45.33 C5-1.1 36.03,45.36 IC5-1.9 | 27.74,56.66 27.74,58.56 27.11,59.2 25.3,59.2 SJ2.3 | D5-1.1 27.75,56.83 27.74,56.66
RTD2+  (via drill 0.6)
  Top 0.406: v32.03,26.02 32.03,33.8 33.04,34.81 35.84,34.81 C5-2.2 | D5-2.2 21.22,20.14 20.6,19.51 20.6,15.17 U4.4 | IC5-2.7 36.03,34.78 C5-2.2 | IC5-2.5 36.47,36.49 35.84,35.86 C5-2.2
  Bottom 0.406: U4.4 20.71,17.08 21.23,17.61 23.14,17.61 24.09,18.4 24.09,24.12 24.89,24.91 31.39,24.91 32.03,25.54 v32.03,26.02
RTD2-  (via drill 0.5)
  Top 0.254: IC5-2.8 IC5-2.9
  Top 0.406: D5-2.1 24.09,24.11 24.57,24.59 33.62,24.59 34.09,25.07 v34.09,26.02 34.09,33.01 34.35,33.27 C5-2.1 36.03,33.46 IC5-2.9
  Bottom 0.406: v34.09,26.02 34.09,15.86 34.57,15.38 35.05,15.38 35.68,15.23 35.68,15.09 U4.1
RTD3+
  Top 0.254: 36.03,22.55 C6-1.2
  Top 0.406: IC6-1.7 36.03,22.55 | U4.3 25.71,20.15 | 25.71,20.15 25.71,21.45 26.95,22.69 35.62,22.69 C6-1.2 35.84,23.8 36.31,24.27 IC6-1.5 | D6-1.2 25.72,20.14 25.71,20.15
RTD3-
  Top 0.254: IC6-1.8 IC6-1.9 | 36.03,21.23 C6-1.1
  Top 0.406: IC6-1.9 36.03,21.23 | U4.2 30.71,19.78 | 30.71,19.78 31.87,20.94 35.74,20.94 C6-1.1 | D6-1.1 30.36,20.14 30.71,19.78
SPI2_MISO  (via drill 0.3)
  Top 0.254: IC6-1.14 40.44,19.52 v40.44,18.2 40.44,17.77 40.92,17.29 54.09,17.29 54.52,17.71 IC1-1.35 | v40.44,30.62 40.47,30.62 IC5-2.14 | IC5-1.14 40.44,43.65 v40.44,42.05
  Bottom 0.254: v40.44,18.2 v40.44,30.62 v40.44,42.05
SPI2_MOSI  (via drill 0.3)
  Top 0.254: IC6-1.11 38.54,19.52 v38.54,18.4 | v38.54,30.62 38.49,30.47 IC5-2.11 | IC5-1.11 38.54,43.65 v38.54,42.21 | IC1-1.34 54.02,35.79 v54.09,35.86
  Bottom 0.254: v38.54,42.21 v38.54,30.62 v38.54,18.4 38.54,17.29 39.49,16.34 53.78,16.34 54.09,16.65 v54.09,35.86
SPI2_SCK  (via drill 0.3)
  Top 0.254: IC6-1.12 39.17,19.52 v39.17,17.61 39.97,16.81 54.41,16.81 55.05,17.45 55.05,34.29 IC1-1.36 | v39.17,29.99 39.15,29.99 IC5-2.12 | IC5-1.12 39.17,43.65 v39.17,41.58
  Bottom 0.254: v39.17,17.61 v39.17,29.99 v39.17,41.58
SUPPLY_24V
  Top 0.508: F3-2.2A 44.63,71.74 F3-1.2
  pour Bottom: 36.32,80 97.28,80 99.18,78.09 99.18,70.63 85.69,70.63 83.78,72.22 81.08,72.22 81.08,68.25 79.81,66.98 42.67,66.98 38.06,62.69 14.73,62.69 14.73,67.3 33.14,67.3 33.14,76.82 36.32,76.82
USART2_RX
  Top 0.305: JP2-2.3 59.17,58.09 58.86,57.77 51.4,57.77 50.44,56.82 50.44,44.44 51.14,43.74 IC1-1.17
USART2_TX  (via drill 0.3)
  Top 0.305: JP2-2.2 56.64,59.52 55.84,58.72 50.44,58.72 49.49,57.77 v49.49,47.61 | v52.83,47.13 53.52,46.44 IC1-1.16
  Bottom 0.305: v49.49,47.61 49.97,47.13 v52.83,47.13

### Text on the board
Top: TOP | GND in Top-Layer
Bottom: BOTTOM | +3V3 in Bottom-Layer | VERSION 0.1 | A. Prebeck | SOLARREGLER | PT100/PT1000
Information_bestückungsdruck: IC1 | IC2 | IC3
Beschriftung_TOP: - | - | TP3-1 | RX | + | TP3-2 | - | TX | JP3-1 | UART | 1 | 2 | 3 | TP4-1 | TP4-2 | TP4-3 | SJ4-4 | SJ4-3 | JTAG | CAN-ID 8-1 | CAN_TERM | 1 | OFF | ON | 2 | 3